# EAGLE schematic expansion_board_V0 (EAGLE 7.6.0)

## Sheet 1 of 8
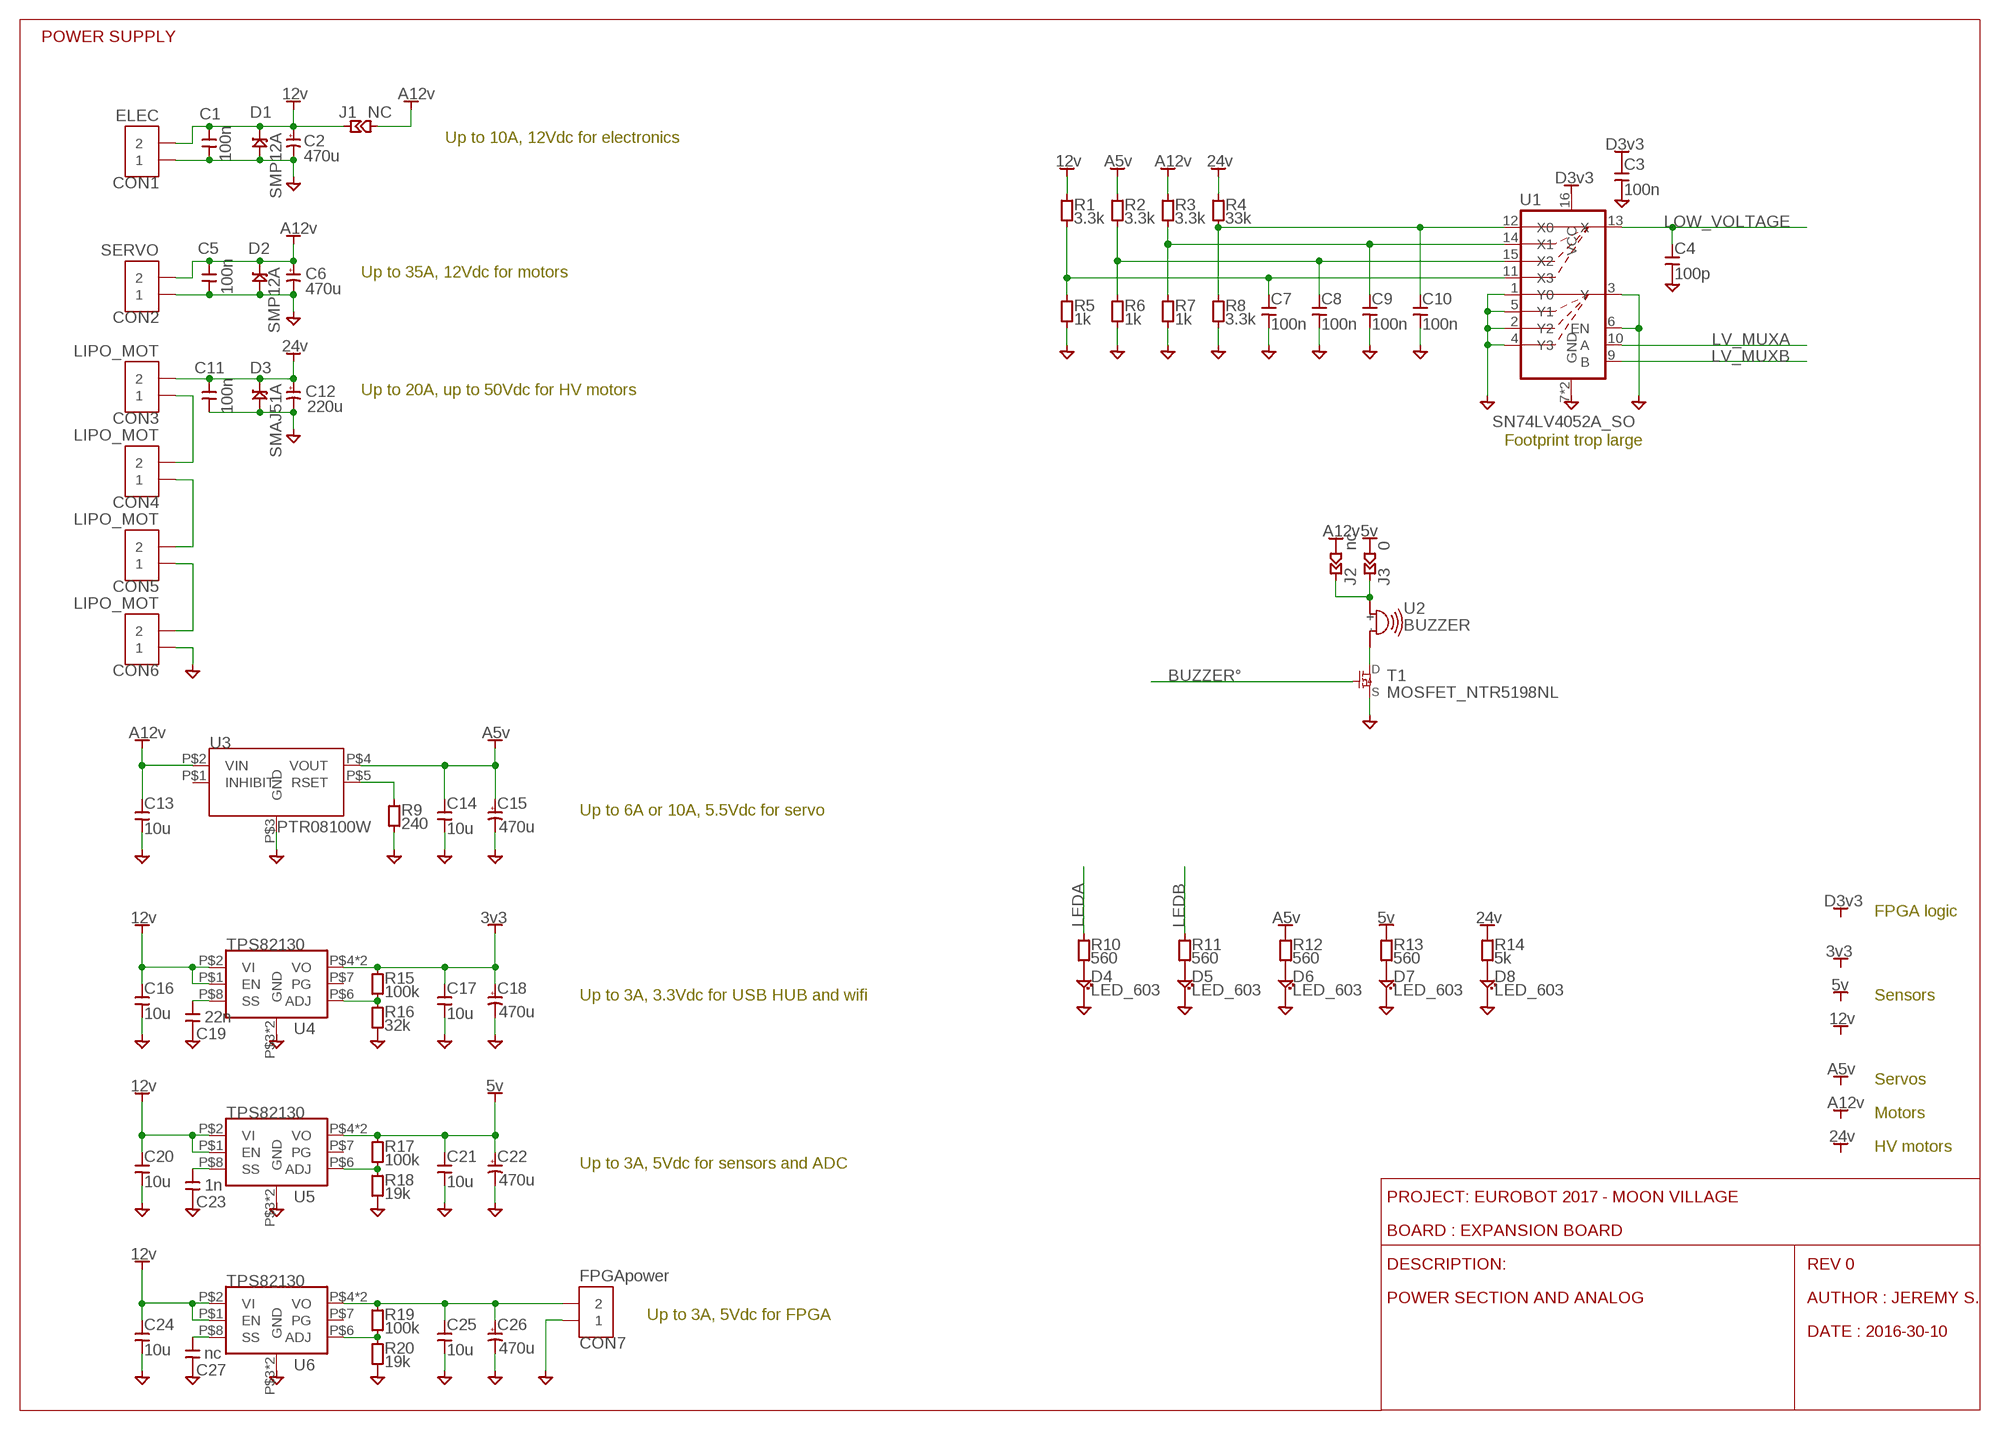
[diagram p0: schematic, sheet 1]

### Parts
C1  100n  C_402  [CAPC1005X55N]
C2  470u  CPOL  [CAPAE835X1020N]
C3  100n  C_402  [CAPC1005X55N]
C4  100p  C_402  [CAPC1005X55N]
C5  100n  C_402  [CAPC1005X55N]
C6  470u  CPOL  [CAPAE835X1020N]
C7  100n  C_402  [CAPC1005X55N]
C8  100n  C_402  [CAPC1005X55N]
C9  100n  C_402  [CAPC1005X55N]
C10  100n  C_402  [CAPC1005X55N]
C11  100n  C_805  [CAPC2013X100N]
C12  220u  CPOL  [CAPAE835X1020N]
C13  10u  C_805  [CAPC2013X100N]
C14  10u  C_805  [CAPC2013X100N]
C15  470u  CPOL  [CAPAE835X1020N]
C16  10u  C_805  [CAPC2013X100N]
C17  10u  C_805  [CAPC2013X100N]
C18  470u  CPOL  [CAPAE835X1020N]
C19  22n  C_402  [CAPC1005X55N]
C20  10u  C_805  [CAPC2013X100N]
C21  10u  C_805  [CAPC2013X100N]
C22  470u  CPOL  [CAPAE835X1020N]
C23  1n  C_402  [CAPC1005X55N]
C24  10u  C_805  [CAPC2013X100N]
C25  10u  C_805  [CAPC2013X100N]
C26  470u  CPOL  [CAPAE835X1020N]
C27  nc  C_402  [CAPC1005X55N]
CON1  ELEC  CON2_3.81  [PHOENIX381P900X920-2N]
CON2  SERVO  CON2_3.81  [PHOENIX381P900X920-2N]
CON3  LIPO_MOT  CON2_3.81  [PHOENIX381P900X920-2N]
CON4  LIPO_MOT  CON2_3.81  [PHOENIX381P900X920-2N]
CON5  LIPO_MOT  CON2_3.81  [PHOENIX381P900X920-2N]
CON6  LIPO_MOT  CON2_3.81  [PHOENIX381P900X920-2N]
CON7  FPGApower  CON2_3.81  [PHOENIX381P900X920-2N]
D1  SMP12A  ZENER  [DO220AA]
D2  SMP12A  ZENER  [DO220AA]
D3  SMAJ51A  ZENERDO214  [D0214AC]
D4  LED_603  [LEDC1608X60N]
D5  LED_603  [LEDC1608X60N]
D6  LED_603  [LEDC1608X60N]
D7  LED_603  [LEDC1608X60N]
D8  LED_603  [LEDC1608X60N]
J1  NC  JUMP_603  [JUMC1608X50AN]
J2  nc  JUMP_402  [JUMC1005X50N]
J3  0  JUMP_402  [JUMC1005X50N]
R1  3.3k  R_402  [RESC1005X40N]
R2  3.3k  R_402  [RESC1005X40N]
R3  3.3k  R_402  [RESC1005X40N]
R4  33k  R_402  [RESC1005X40N]
R5  1k  R_402  [RESC1005X40N]
R6  1k  R_402  [RESC1005X40N]
R7  1k  R_402  [RESC1005X40N]
R8  3.3k  R_402  [RESC1005X40N]
R9  240  R_402  [RESC1005X40N]
R10  560  R_402  [RESC1005X40N]
R11  560  R_402  [RESC1005X40N]
R12  560  R_402  [RESC1005X40N]
R13  560  R_402  [RESC1005X40N]
R14  5k  R_402  [RESC1005X40N]
R15  100k  R_402  [RESC1005X40N]
R16  32k  R_402  [RESC1005X40N]
R17  100k  R_402  [RESC1005X40N]
R18  19k  R_402  [RESC1005X40N]
R19  100k  R_402  [RESC1005X40N]
R20  19k  R_402  [RESC1005X40N]
T1  MOSFET_NTR5198NL  [SOT95P290X130-3N]
U1  SN74LV4052A_SO  [SOIC127P780X200-16N]
U2  BUZZER  [BUZZER_CIRCLE]
U3  PTR08100W  [PTR08100W]
U4  TPS82130  [SON65P310X290X153-9N]
U5  TPS82130  [SON65P310X290X153-9N]
U6  TPS82130  [SON65P310X290X153-9N]

### Nets
3V3: C17.P$1 C18.+ R15.1 U4.P$4(VO) U4.P$5(VO) ; also sheet 5
5V: C21.P$1 C22.+ J3.P$1 R13.1 R17.1 U5.P$4(VO) U5.P$5(VO) ; also sheet 2,3,4,5,6,7
12V: C1.1 C2.+ C16.P$1 C20.P$1 C24.P$1 CON1.P$2 D1.C J1.P$2 R1.1 U4.P$1(EN) U4.P$2(VI) U5.P$1(EN) U5.P$2(VI) U6.P$1(EN) U6.P$2(VI) ; also sheet 4
24V: C11.P$1 C12.+ CON3.P$2 D3.C R4.1 R14.1 ; also sheet 2,3
A5V: C14.P$1 C15.+ R2.1 R12.1 U3.P$4(VOUT) ; also sheet 3,4
A12V: C5.1 C6.+ C13.P$1 CON2.P$2 D2.C J1.P$1 J2.P$1 R3.1 U3.P$2(VIN) ; also sheet 2,3
BUZZER°: T1.P$1(G) ; also sheet 7
D3V3: C3.1 U1.16(VCC) ; also sheet 6,7
GND: C1.2 C2.- C3.2 C4.2 C5.2 C6.- C7.2 C8.2 C9.2 C10.2 C11.P$2 C12.- C13.P$2 C14.P$2 C15.- C16.P$2 C17.P$2 C18.- C19.2 C20.P$2 C21.P$2 C22.- C23.2 C24.P$2 C25.P$2 C26.- C27.2 CON1.P$1 CON2.P$1 CON6.P$1 CON7.P$1 D1.A D2.A D3.A D4.C D5.C D6.C D7.C D8.C R5.2 R6.2 R7.2 R8.2 R9.2 R16.2 R18.2 R20.2 T1.P$2(S) U1.1(Y0) U1.2(Y2) U1.3(Y) U1.4(Y3) U1.5(Y1) U1.6(EN) U1.7(GND) U1.8(GND) U3.P$3(GND) U4.P$3(GND) U4.P$9(GND) U5.P$3(GND) U5.P$9(GND) U6.P$3(GND) U6.P$9(GND) ; also sheet 2,3,4,5,6,7,8
LEDA: R10.1 ; also sheet 7
LEDB: R11.1 ; also sheet 7
LOW_VOLTAGE: C4.1 U1.13(X) ; also sheet 6
LV_MUXA: U1.10(A) ; also sheet 7
LV_MUXB: U1.9(B) ; also sheet 7
N$1: CON3.P$1 CON4.P$2
N$3: CON4.P$1 CON5.P$2
N$4: CON5.P$1 CON6.P$2
N$41: D6.A R12.2
N$42: R15.2 R16.1 U4.P$6(ADJ)
N$61: D5.A R11.2
N$64: D4.A R10.2
N$157: C19.1 U4.P$8(SS)
N$198: R17.2 R18.1 U5.P$6(ADJ)
N$199: C23.1 U5.P$8(SS)
N$200: R9.1 U3.P$5(RSET)
N$201: R19.2 R20.1 U6.P$6(ADJ)
N$202: C27.1 U6.P$8(SS)
N$204: D7.A R13.2
N$205: D8.A R14.2
N$206: C25.P$1 C26.+ CON7.P$2 R19.1 U6.P$4(VO) U6.P$5(VO)
N$207: C7.1 R1.2 R5.1 U1.11(X3)
N$210: C10.1 R4.2 R8.1 U1.12(X0)
N$211: C8.1 R2.2 R6.1 U1.15(X2)
N$212: C9.1 R3.2 R7.1 U1.14(X1)
N$213: T1.P$3(D) U2.-
N$214: J2.P$2 J3.P$2 U2.+
Unconnected: U3.P$1(INHIBIT) U4.P$7(PG) U5.P$7(PG) U6.P$7(PG)

### Notes on the sheet
- POWER SUPPLY
- Up to 10A, 12Vdc for electronics
- Up to 35A, 12Vdc for motors
- Up to 20A, up to 50Vdc for HV motors
- Footprint trop large
- Up to 6A or 10A, 5.5Vdc for servo
- FPGA logic
- Up to 3A, 3.3Vdc for USB HUB and wifi | Sensors
- Servos
- Motors
- HV motors
- Up to 3A, 5Vdc for sensors and ADC
- PROJECT: EUROBOT 2017 - MOON VILLAGE
- BOARD : EXPANSION BOARD
- DESCRIPTION: | REV 0
- POWER SECTION AND ANALOG | AUTHOR : JEREMY S.
- Up to 3A, 5Vdc for FPGA
- DATE : 2016-30-10

## Sheet 2 of 8
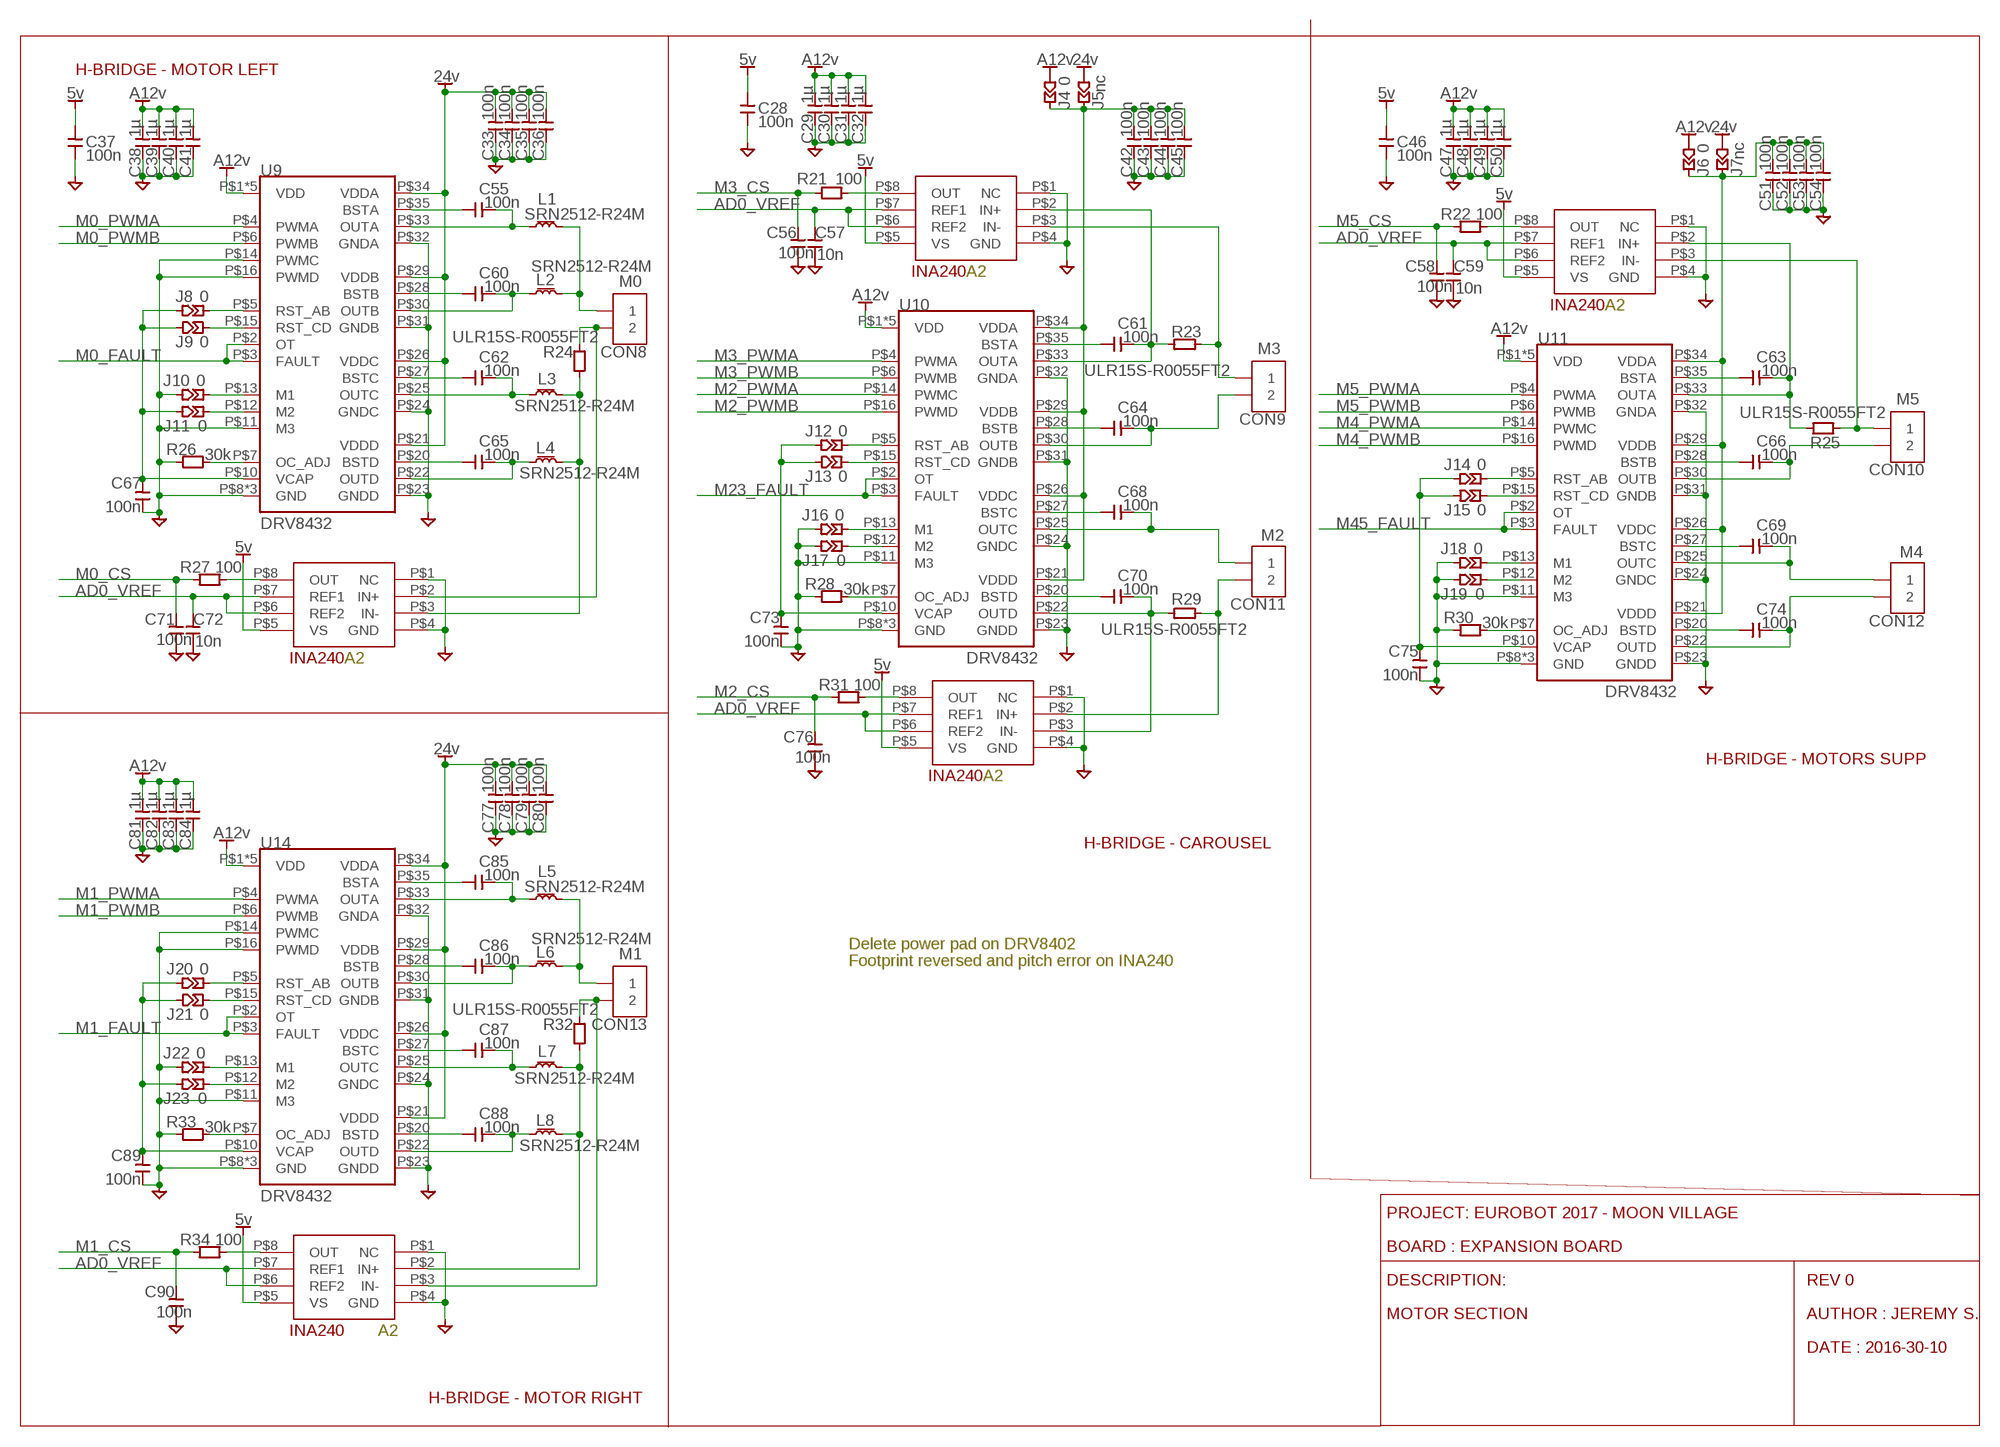
[diagram p1: schematic, sheet 2]

### Parts
C28  100n  C_402  [CAPC1005X55N]
C29  1µ  C_603  [CAPC1608X95N]
C30  1µ  C_603  [CAPC1608X95N]
C31  1µ  C_603  [CAPC1608X95N]
C32  1µ  C_603  [CAPC1608X95N]
C33  100n  C_603  [CAPC1608X95N]
C34  100n  C_603  [CAPC1608X95N]
C35  100n  C_603  [CAPC1608X95N]
C36  100n  C_603  [CAPC1608X95N]
C37  100n  C_402  [CAPC1005X55N]
C38  1µ  C_603  [CAPC1608X95N]
C39  1µ  C_603  [CAPC1608X95N]
C40  1µ  C_603  [CAPC1608X95N]
C41  1µ  C_603  [CAPC1608X95N]
C42  100n  C_603  [CAPC1608X95N]
C43  100n  C_603  [CAPC1608X95N]
C44  100n  C_603  [CAPC1608X95N]
C45  100n  C_603  [CAPC1608X95N]
C46  100n  C_402  [CAPC1005X55N]
C47  1µ  C_603  [CAPC1608X95N]
C48  1µ  C_603  [CAPC1608X95N]
C49  1µ  C_603  [CAPC1608X95N]
C50  1µ  C_603  [CAPC1608X95N]
C51  100n  C_603  [CAPC1608X95N]
C52  100n  C_603  [CAPC1608X95N]
C53  100n  C_603  [CAPC1608X95N]
C54  100n  C_603  [CAPC1608X95N]
C55  100n  C_603  [CAPC1608X95N]
C56  100n  C_402  [CAPC1005X55N]
C57  10n  C_402  [CAPC1005X55N]
C58  100n  C_402  [CAPC1005X55N]
C59  10n  C_402  [CAPC1005X55N]
C60  100n  C_603  [CAPC1608X95N]
C61  100n  C_603  [CAPC1608X95N]
C62  100n  C_603  [CAPC1608X95N]
C63  100n  C_603  [CAPC1608X95N]
C64  100n  C_603  [CAPC1608X95N]
C65  100n  C_603  [CAPC1608X95N]
C66  100n  C_603  [CAPC1608X95N]
C67  100n  C_402  [CAPC1005X55N]
C68  100n  C_603  [CAPC1608X95N]
C69  100n  C_603  [CAPC1608X95N]
C70  100n  C_603  [CAPC1608X95N]
C71  100n  C_402  [CAPC1005X55N]
C72  10n  C_402  [CAPC1005X55N]
C73  100n  C_402  [CAPC1005X55N]
C74  100n  C_603  [CAPC1608X95N]
C75  100n  C_402  [CAPC1005X55N]
C76  100n  C_402  [CAPC1005X55N]
C77  100n  C_603  [CAPC1608X95N]
C78  100n  C_603  [CAPC1608X95N]
C79  100n  C_603  [CAPC1608X95N]
C80  100n  C_603  [CAPC1608X95N]
C81  1µ  C_603  [CAPC1608X95N]
C82  1µ  C_603  [CAPC1608X95N]
C83  1µ  C_603  [CAPC1608X95N]
C84  1µ  C_603  [CAPC1608X95N]
C85  100n  C_603  [CAPC1608X95N]
C86  100n  C_603  [CAPC1608X95N]
C87  100n  C_603  [CAPC1608X95N]
C88  100n  C_603  [CAPC1608X95N]
C89  100n  C_402  [CAPC1005X55N]
C90  100n  C_402  [CAPC1005X55N]
CON8  M0  CON2_3.81  [PHOENIX381P900X920-2N]
CON9  M3  CON2_3.81  [PHOENIX381P900X920-2N]
CON10  M5  CON2_3.81  [PHOENIX381P900X920-2N]
CON11  M2  CON2_3.81  [PHOENIX381P900X920-2N]
CON12  M4  CON2_3.81  [PHOENIX381P900X920-2N]
CON13  M1  CON2_3.81  [PHOENIX381P900X920-2N]
J4  0  JUMP_603  [JUMC1608X50AN]
J5  nc  JUMP_603  [JUMC1608X50AN]
J6  0  JUMP_603  [JUMC1608X50AN]
J7  nc  JUMP_603  [JUMC1608X50AN]
J8  0  JUMP_402  [JUMC1005X50N]
J9  0  JUMP_402  [JUMC1005X50N]
J10  0  JUMP_402  [JUMC1005X50N]
J11  0  JUMP_402  [JUMC1005X50N]
J12  0  JUMP_402  [JUMC1005X50N]
J13  0  JUMP_402  [JUMC1005X50N]
J14  0  JUMP_402  [JUMC1005X50N]
J15  0  JUMP_402  [JUMC1005X50N]
J16  0  JUMP_402  [JUMC1005X50N]
J17  0  JUMP_402  [JUMC1005X50N]
J18  0  JUMP_402  [JUMC1005X50N]
J19  0  JUMP_402  [JUMC1005X50N]
J20  0  JUMP_402  [JUMC1005X50N]
J21  0  JUMP_402  [JUMC1005X50N]
J22  0  JUMP_402  [JUMC1005X50N]
J23  0  JUMP_402  [JUMC1005X50N]
L1  SRN2512-R24M  INDUCTANCE_2520  [INDC2520X120N]
L2  SRN2512-R24M  INDUCTANCE_2520  [INDC2520X120N]
L3  SRN2512-R24M  INDUCTANCE_2520  [INDC2520X120N]
L4  SRN2512-R24M  INDUCTANCE_2520  [INDC2520X120N]
L5  SRN2512-R24M  INDUCTANCE_2520  [INDC2520X120N]
L6  SRN2512-R24M  INDUCTANCE_2520  [INDC2520X120N]
L7  SRN2512-R24M  INDUCTANCE_2520  [INDC2520X120N]
L8  SRN2512-R24M  INDUCTANCE_2520  [INDC2520X120N]
R21  100  R_402  [RESC1005X40N]
R22  100  R_402  [RESC1005X40N]
R23  ULR15S-R0055FT2  R_ULR15S-R0055FT2  [RESC_ULR15S-R0055FT2]
R24  ULR15S-R0055FT2  R_ULR15S-R0055FT2  [RESC_ULR15S-R0055FT2]
R25  ULR15S-R0055FT2  R_ULR15S-R0055FT2  [RESC_ULR15S-R0055FT2]
R26  30k  R_402  [RESC1005X40N]
R27  100  R_402  [RESC1005X40N]
R28  30k  R_402  [RESC1005X40N]
R29  ULR15S-R0055FT2  R_ULR15S-R0055FT2  [RESC_ULR15S-R0055FT2]
R30  30k  R_402  [RESC1005X40N]
R31  100  R_402  [RESC1005X40N]
R32  ULR15S-R0055FT2  R_ULR15S-R0055FT2  [RESC_ULR15S-R0055FT2]
R33  30k  R_402  [RESC1005X40N]
R34  100  R_402  [RESC1005X40N]
U7  INA240-A2  INA240-TSSOP  [TSSOP]
U8  INA240-A2  INA240-TSSOP  [TSSOP]
U9  DRV8432  DRV84X2_DRV8432  [R-PDSO-G36]
U10  DRV8432  DRV84X2_DRV8432  [R-PDSO-G36]
U11  DRV8432  DRV84X2_DRV8432  [R-PDSO-G36]
U12  INA240-A2  INA240-TSSOP  [TSSOP]
U13  INA240-A2  INA240-TSSOP  [TSSOP]
U14  DRV8432  DRV84X2_DRV8432  [R-PDSO-G36]
U15  INA240-A2  INA240-TSSOP  [TSSOP]

### Nets
5V: C28.2 C37.2 C46.2 U7.P$5(VS) U8.P$5(VS) U12.P$5(VS) U13.P$5(VS) U15.P$5(VS) ; also sheet 1,3,4,5,6,7
24V: C33.P$2 C34.P$2 C35.P$2 C36.P$2 C77.P$2 C78.P$2 C79.P$2 C80.P$2 J5.P$1 J7.P$1 U9.P$21(VDDD) U9.P$26(VDDC) U9.P$29(VDDB) U9.P$34(VDDA) U14.P$21(VDDD) U14.P$26(VDDC) U14.P$29(VDDB) U14.P$34(VDDA) ; also sheet 1,3
A12V: C29.P$2 C30.P$2 C31.P$2 C32.P$2 C38.P$2 C39.P$2 C40.P$2 C41.P$2 C47.P$2 C48.P$2 C49.P$2 C50.P$2 C81.P$2 C82.P$2 C83.P$2 C84.P$2 J4.P$1 J6.P$1 U9.P$1(VDD) U9.P$17(VDD) U9.P$18(VDD) U9.P$19(VDD) U9.P$36(VDD) U10.P$1(VDD) U10.P$17(VDD) U10.P$18(VDD) U10.P$19(VDD) U10.P$36(VDD) U11.P$1(VDD) U11.P$17(VDD) U11.P$18(VDD) U11.P$19(VDD) U11.P$36(VDD) U14.P$1(VDD) U14.P$17(VDD) U14.P$18(VDD) U14.P$19(VDD) U14.P$36(VDD) ; also sheet 1,3
AD0_VREF: C57.2 C59.2 C72.2 U7.P$6(REF2) U7.P$7(REF1) U8.P$6(REF2) U8.P$7(REF1) U12.P$6(REF2) U12.P$7(REF1) U13.P$6(REF2) U13.P$7(REF1) U15.P$6(REF2) U15.P$7(REF1) ; also sheet 3,6
GND: C28.1 C29.P$1 C30.P$1 C31.P$1 C32.P$1 C33.P$1 C34.P$1 C35.P$1 C36.P$1 C37.1 C38.P$1 C39.P$1 C40.P$1 C41.P$1 C42.P$1 C43.P$1 C44.P$1 C45.P$1 C46.1 C47.P$1 C48.P$1 C49.P$1 C50.P$1 C51.P$1 C52.P$1 C53.P$1 C54.P$1 C56.1 C57.1 C58.1 C59.1 C67.1 C71.1 C72.1 C73.1 C75.1 C76.1 C77.P$1 C78.P$1 C79.P$1 C80.P$1 C81.P$1 C82.P$1 C83.P$1 C84.P$1 C89.1 C90.1 J10.P$1 J16.P$1 J17.P$1 J18.P$1 J19.P$1 J22.P$1 R26.2 R28.2 R30.2 R33.2 U7.P$1(NC) U7.P$4(GND) U8.P$1(NC) U8.P$4(GND) U9.P$8(GND) U9.P$9(GND) U9.P$11(M3) U9.P$14(PWMC) U9.P$16(PWMD) U9.P$23(GNDD) U9.P$24(GNDC) U9.P$31(GNDB) U9.P$32(GNDA) U9.P$37(GND) U10.P$8(GND) U10.P$9(GND) U10.P$11(M3) U10.P$23(GNDD) U10.P$24(GNDC) U10.P$31(GNDB) U10.P$32(GNDA) U10.P$37(GND) U11.P$8(GND) U11.P$9(GND) U11.P$11(M3) U11.P$23(GNDD) U11.P$24(GNDC) U11.P$31(GNDB) U11.P$32(GNDA) U11.P$37(GND) U12.P$1(NC) U12.P$4(GND) U13.P$1(NC) U13.P$4(GND) U14.P$8(GND) U14.P$9(GND) U14.P$11(M3) U14.P$14(PWMC) U14.P$16(PWMD) U14.P$23(GNDD) U14.P$24(GNDC) U14.P$31(GNDB) U14.P$32(GNDA) U14.P$37(GND) U15.P$1(NC) U15.P$4(GND) ; also sheet 1,3,4,5,6,7,8
M0_CS: C71.2 R27.2 ; also sheet 6
M0_FAULT: U9.P$2(OT) U9.P$3(FAULT) ; also sheet 7
M0_PWMA: U9.P$4(PWMA) ; also sheet 7
M0_PWMB: U9.P$6(PWMB) ; also sheet 7
M1_CS: C90.2 R34.2 ; also sheet 6
M1_FAULT: U14.P$2(OT) U14.P$3(FAULT) ; also sheet 7
M1_PWMA: U14.P$4(PWMA) ; also sheet 7
M1_PWMB: U14.P$6(PWMB) ; also sheet 7
M2_CS: C76.2 R31.2 ; also sheet 6
M2_PWMA: U10.P$14(PWMC) ; also sheet 7
M2_PWMB: U10.P$16(PWMD) ; also sheet 7
M3_CS: C56.2 R21.2 ; also sheet 6
M3_PWMA: U10.P$4(PWMA) ; also sheet 7
M3_PWMB: U10.P$6(PWMB) ; also sheet 7
M4_PWMA: U11.P$14(PWMC) ; also sheet 7
M4_PWMB: U11.P$16(PWMD) ; also sheet 7
M5_CS: C58.2 R22.2 ; also sheet 6
M5_PWMA: U11.P$4(PWMA) ; also sheet 7
M5_PWMB: U11.P$6(PWMB) ; also sheet 7
M23_FAULT: U10.P$2(OT) U10.P$3(FAULT) ; also sheet 7
M45_FAULT: U11.P$2(OT) U11.P$3(FAULT) ; also sheet 7
N$5: J13.P$2 U10.P$15(RST_CD)
N$7: C61.P$1 U10.P$35(BSTA)
N$8: C70.P$1 U10.P$20(BSTD)
N$9: CON8.P$2 R24.P$2 U12.P$2(IN+)
N$10: C68.P$1 U10.P$27(BSTC)
N$11: CON13.P$2 R32.P$2 U15.P$3(IN-)
N$12: C64.P$1 U10.P$28(BSTB)
N$13: CON10.P$1 R25.P$2 U8.P$3(IN-)
N$14: C61.P$2 R23.P$1 U7.P$2(IN+) U10.P$33(OUTA)
N$15: C74.P$2 CON12.P$2 U11.P$22(OUTD)
N$16: C64.P$2 CON9.P$2 U10.P$30(OUTB)
N$17: J20.P$2 U14.P$5(RST_AB)
N$18: J16.P$2 U10.P$13(M1)
N$19: J8.P$2 U9.P$5(RST_AB)
N$20: J12.P$2 U10.P$5(RST_AB)
N$22: J14.P$2 U11.P$5(RST_AB)
N$46: J17.P$2 U10.P$12(M2)
N$55: C68.P$2 CON11.P$1 U10.P$25(OUTC)
N$56: C70.P$2 R29.P$1 U10.P$22(OUTD) U13.P$3(IN-)
N$57: C73.2 J12.P$1 J13.P$1 U10.P$10(VCAP)
N$60: CON9.P$1 R23.P$2 U7.P$3(IN-)
N$62: R28.1 U10.P$7(OC_ADJ)
N$65: R21.1 U7.P$8(OUT)
N$76: CON11.P$2 R29.P$2 U13.P$2(IN+)
N$77: C63.P$1 U11.P$35(BSTA)
N$78: C74.P$1 U11.P$20(BSTD)
N$79: C69.P$1 U11.P$27(BSTC)
N$80: C66.P$1 U11.P$28(BSTB)
N$81: C63.P$2 R25.P$1 U8.P$2(IN+) U11.P$33(OUTA)
N$82: C66.P$2 CON10.P$2 U11.P$30(OUTB)
N$83: C69.P$2 CON12.P$1 U11.P$25(OUTC)
N$85: C75.2 J14.P$1 J15.P$1 U11.P$10(VCAP)
N$86: R30.1 U11.P$7(OC_ADJ)
N$87: C42.P$2 C43.P$2 C44.P$2 C45.P$2 J4.P$2 J5.P$2 U10.P$21(VDDD) U10.P$26(VDDC) U10.P$29(VDDB) U10.P$34(VDDA)
N$88: J15.P$2 U11.P$15(RST_CD)
N$89: R31.1 U13.P$8(OUT)
N$90: J18.P$2 U11.P$13(M1)
N$91: J19.P$2 U11.P$12(M2)
N$92: C51.P$2 C52.P$2 C53.P$2 C54.P$2 J6.P$2 J7.P$2 U11.P$21(VDDD) U11.P$26(VDDC) U11.P$29(VDDB) U11.P$34(VDDA)
N$99: C85.P$1 U14.P$35(BSTA)
N$100: C88.P$1 U14.P$20(BSTD)
N$101: C87.P$1 U14.P$27(BSTC)
N$102: C86.P$1 U14.P$28(BSTB)
N$103: C85.P$2 L5.P$2 U14.P$33(OUTA)
N$104: C86.P$2 L6.P$2 U14.P$30(OUTB)
N$105: C87.P$2 L7.P$2 U14.P$25(OUTC)
N$106: C88.P$2 L8.P$2 U14.P$22(OUTD)
N$114: C89.2 J20.P$1 J21.P$1 J23.P$1 U14.P$10(VCAP)
N$115: R33.1 U14.P$7(OC_ADJ)
N$116: C55.P$1 U9.P$35(BSTA)
N$117: J21.P$2 U14.P$15(RST_CD)
N$118: J22.P$2 U14.P$13(M1)
N$119: J23.P$2 U14.P$12(M2)
N$120: C65.P$1 U9.P$20(BSTD)
N$121: R34.1 U15.P$8(OUT)
N$123: C62.P$1 U9.P$27(BSTC)
N$124: L7.P$1 L8.P$1 R32.P$1 U15.P$2(IN+)
N$125: C60.P$1 U9.P$28(BSTB)
N$126: CON13.P$1 L5.P$1 L6.P$1
N$127: C55.P$2 L1.P$2 U9.P$33(OUTA)
N$128: C60.P$2 L2.P$2 U9.P$30(OUTB)
N$129: C62.P$2 L3.P$2 U9.P$25(OUTC)
N$130: C65.P$2 L4.P$2 U9.P$22(OUTD)
N$131: C67.2 J8.P$1 J9.P$1 J11.P$1 U9.P$10(VCAP)
N$132: R26.1 U9.P$7(OC_ADJ)
N$133: J9.P$2 U9.P$15(RST_CD)
N$134: J10.P$2 U9.P$13(M1)
N$135: J11.P$2 U9.P$12(M2)
N$136: R27.1 U12.P$8(OUT)
N$138: L3.P$1 L4.P$1 R24.P$1 U12.P$3(IN-)
N$139: CON8.P$1 L1.P$1 L2.P$1
N$208: R22.1 U8.P$8(OUT)

### Notes on the sheet
- H-BRIDGE - MOTOR LEFT
- A2
- A2
- A2
- H-BRIDGE - MOTORS SUPP
- A2
- H-BRIDGE - CAROUSEL
- Delete power pad on DRV8402
- Footprint reversed and pitch error on INA240
- PROJECT: EUROBOT 2017 - MOON VILLAGE
- BOARD : EXPANSION BOARD
- DESCRIPTION: | REV 0
- MOTOR SECTION | AUTHOR : JEREMY S.
- A2
- DATE : 2016-30-10
- H-BRIDGE - MOTOR RIGHT

## Sheet 3 of 8
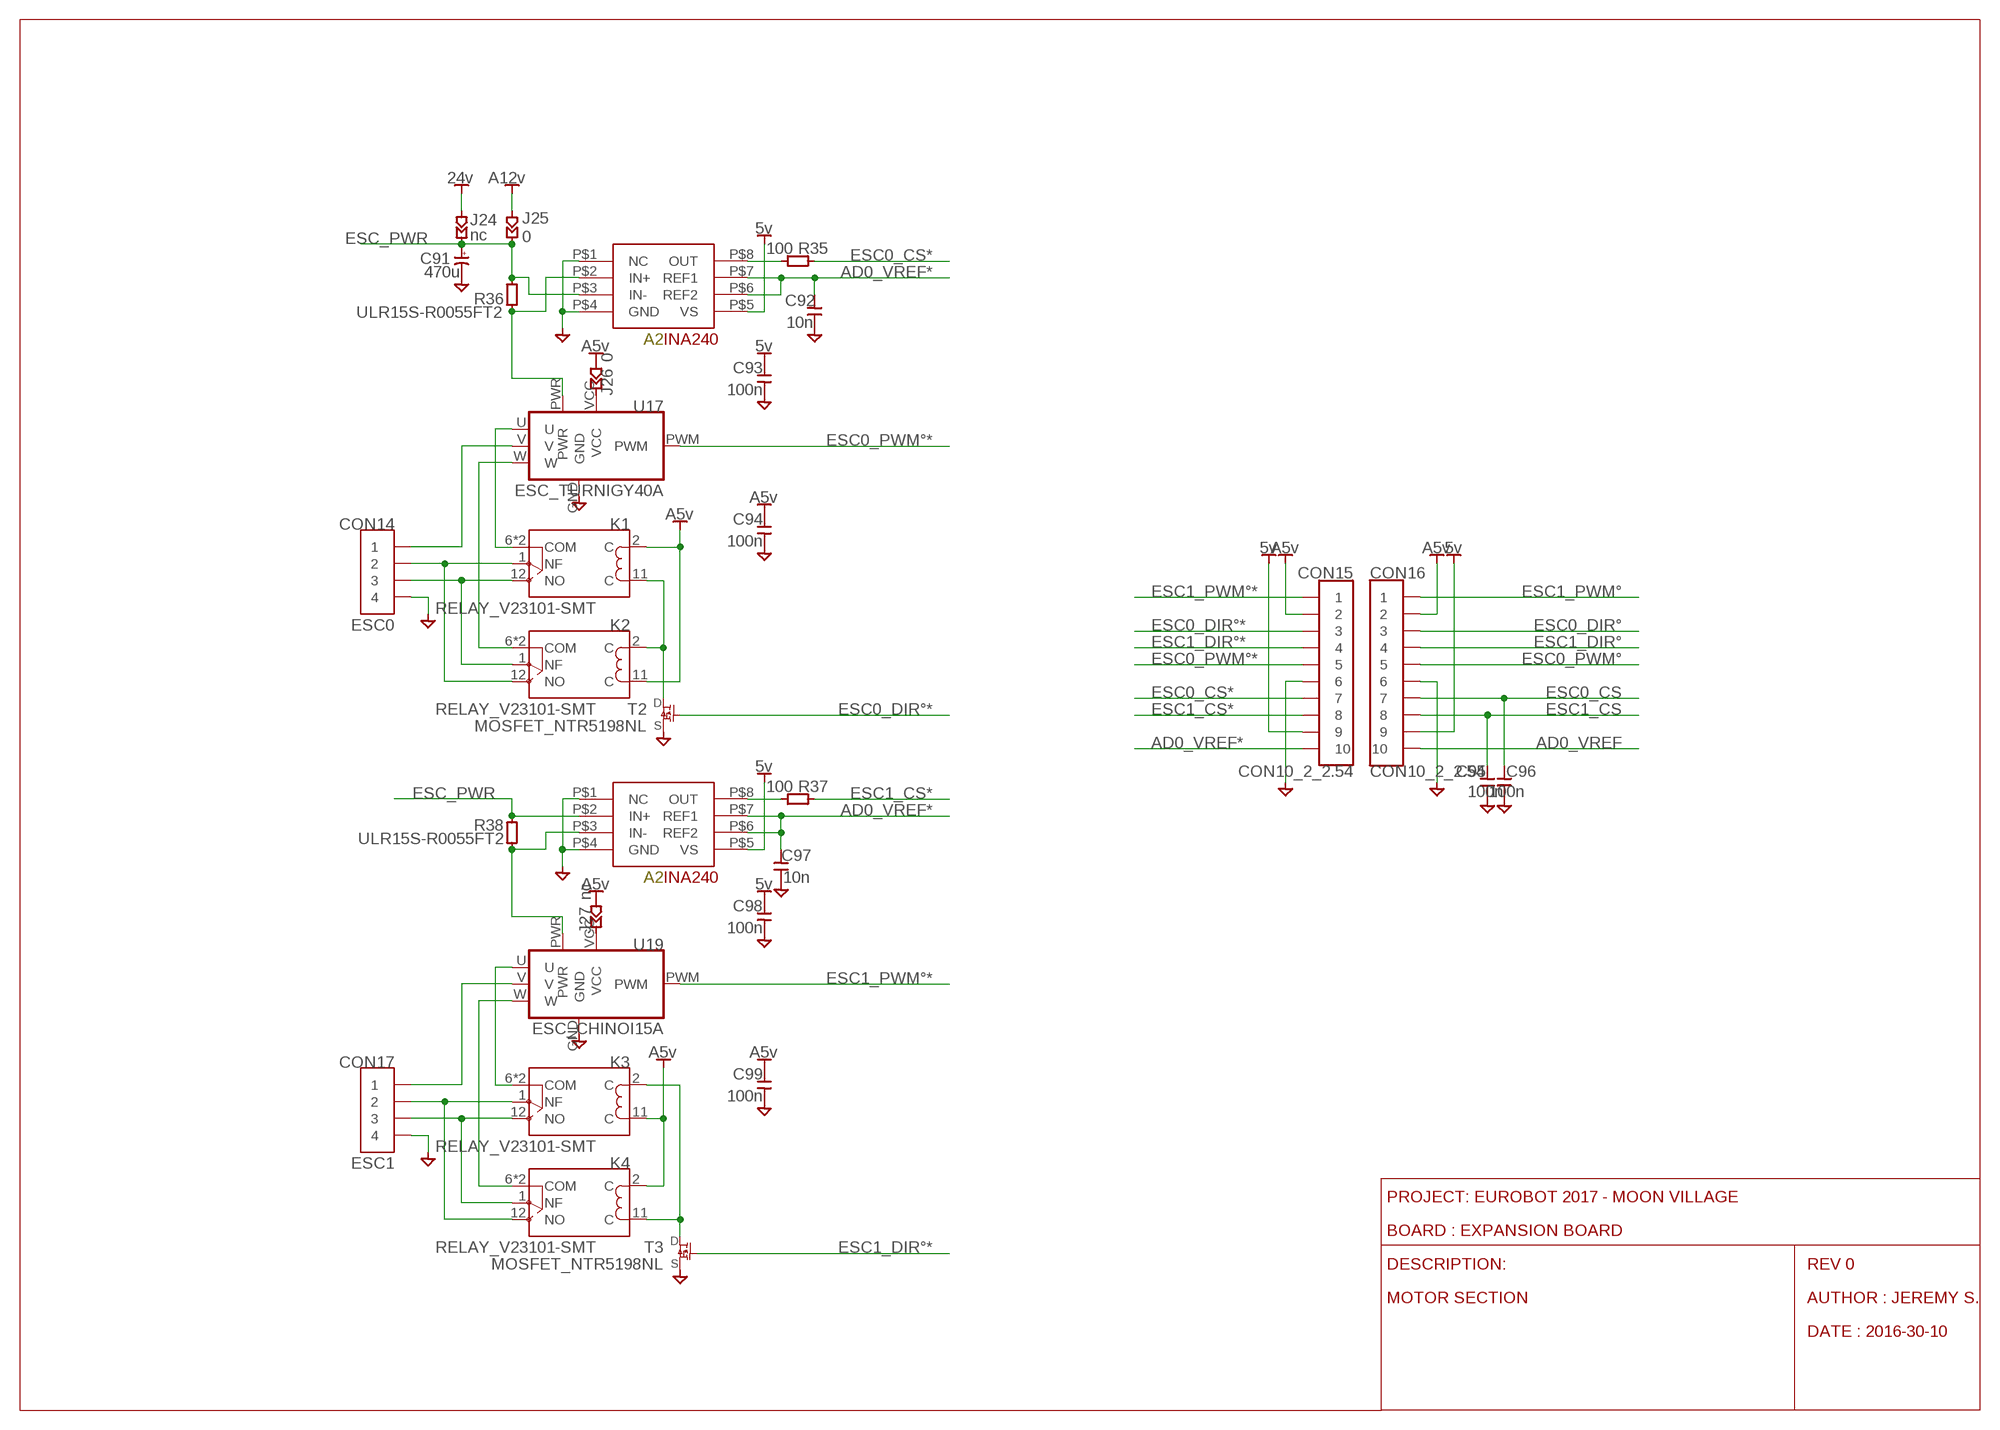
[diagram p2: schematic, sheet 3]

### Parts
C91  470u  CPOL  [CAPAE835X1020N]
C92  10n  C_402  [CAPC1005X55N]
C93  100n  C_402  [CAPC1005X55N]
C94  100n  C_402  [CAPC1005X55N]
C95  100n  C_402  [CAPC1005X55N]
C96  100n  C_402  [CAPC1005X55N]
C97  10n  C_402  [CAPC1005X55N]
C98  100n  C_402  [CAPC1005X55N]
C99  100n  C_402  [CAPC1005X55N]
CON14  ESC0  CON4_3.81  [PHOENIX381P1662X920-4N]
CON15  CON10_2_2.54  [CON245P2030X890-2X5N]
CON16  CON10_2_2.54  [CON245P2030X890-2X5N]
CON17  ESC1  CON4_3.81  [PHOENIX381P1662X920-4N]
J24  nc  JUMP_603  [JUMC1608X50AN]
J25  0  JUMP_603  [JUMC1608X50AN]
J26  0  JUMP_402  [JUMC1005X50N]
J27  nc  JUMP_402  [JUMC1005X50N]
K1  RELAY_V23101-SMT  [V23101-D0103-A201-SMT]
K2  RELAY_V23101-SMT  [V23101-D0103-A201-SMT]
K3  RELAY_V23101-SMT  [V23101-D0103-A201-SMT]
K4  RELAY_V23101-SMT  [V23101-D0103-A201-SMT]
R35  100  R_402  [RESC1005X40N]
R36  ULR15S-R0055FT2  R_ULR15S-R0055FT2  [RESC_ULR15S-R0055FT2]
R37  100  R_402  [RESC1005X40N]
R38  ULR15S-R0055FT2  R_ULR15S-R0055FT2  [RESC_ULR15S-R0055FT2]
T2  MOSFET_NTR5198NL  [SOT95P290X130-3N]
T3  MOSFET_NTR5198NL  [SOT95P290X130-3N]
U16  INA240-A2  INA240-TSSOP  [TSSOP]
U17  ESC_TURNIGY40A  [ESC_TURNIGY40A]
U18  INA240-A2  INA240-TSSOP  [TSSOP]
U19  ESC_CHINOI15A  [ESC_CHINOI15A]

### Nets
5V: C93.1 C98.1 CON15.P$9 CON16.P$9 U16.P$5(VS) U18.P$5(VS) ; also sheet 1,2,4,5,6,7
24V: J24.P$1 ; also sheet 1,2
A5V: C94.1 C99.1 CON15.P$2 CON16.P$2 J26.P$1 J27.P$1 K1.2(C) K2.11(C) K3.11(C) K4.2(C) ; also sheet 1,4
A12V: J25.P$1 ; also sheet 1,2
AD0_VREF: CON16.P$10 ; also sheet 2,6
AD0_VREF*: C92.2 C97.2 CON15.P$10 U16.P$6(REF2) U16.P$7(REF1) U18.P$6(REF2) U18.P$7(REF1)
ESC0_CS: C96.2 CON16.P$7 ; also sheet 6
ESC0_CS*: CON15.P$7 R35.2
ESC0_DIR°: CON16.P$3 ; also sheet 7
ESC0_DIR°*: CON15.P$3 T2.P$1(G)
ESC0_PWM°: CON16.P$5 ; also sheet 7
ESC0_PWM°*: CON15.P$5 U17.PWM
ESC1_CS: C95.2 CON16.P$8 ; also sheet 6
ESC1_CS*: CON15.P$8 R37.2
ESC1_DIR°: CON16.P$4 ; also sheet 7
ESC1_DIR°*: CON15.P$4 T3.P$1(G)
ESC1_PWM°: CON16.P$1 ; also sheet 7
ESC1_PWM°*: CON15.P$1 U19.PWM
ESC_PWR: C91.+ J24.P$2 J25.P$2 R36.P$2 R38.P$2 U16.P$3(IN-) U18.P$2(IN+)
GND: C91.- C92.1 C93.2 C94.2 C95.1 C96.1 C97.1 C98.2 C99.2 CON14.P$4 CON15.P$6 CON16.P$6 CON17.P$4 T2.P$2(S) T3.P$2(S) U16.P$1(NC) U16.P$4(GND) U17.GND U18.P$1(NC) U18.P$4(GND) U19.GND ; also sheet 1,2,4,5,6,7,8
N$52: K3.2(C) K4.11(C) T3.P$3(D)
N$63: K1.11(C) K2.2(C) T2.P$3(D)
N$177: K2.6(COM) K2.7(COM) U17.W
N$178: K1.6(COM) K1.7(COM) U17.U
N$180: CON14.P$2 K1.1(NF) K2.12(NO)
N$181: CON14.P$3 K1.12(NO) K2.1(NF)
N$182: CON14.P$1 U17.V
N$184: R35.1 U16.P$8(OUT)
N$185: R36.P$1 U16.P$2(IN+) U17.PWR
N$187: J27.P$2 U19.VCC
N$188: J26.P$2 U17.VCC
N$189: K4.6(COM) K4.7(COM) U19.W
N$190: K3.6(COM) K3.7(COM) U19.U
N$191: CON17.P$2 K3.1(NF) K4.12(NO)
N$192: CON17.P$3 K3.12(NO) K4.1(NF)
N$193: CON17.P$1 U19.V
N$195: R37.1 U18.P$8(OUT)
N$196: R38.P$1 U18.P$3(IN-) U19.PWR

### Notes on the sheet
- A2
- A2
- PROJECT: EUROBOT 2017 - MOON VILLAGE
- BOARD : EXPANSION BOARD
- DESCRIPTION: | REV 0
- MOTOR SECTION | AUTHOR : JEREMY S.
- DATE : 2016-30-10

## Sheet 4 of 8
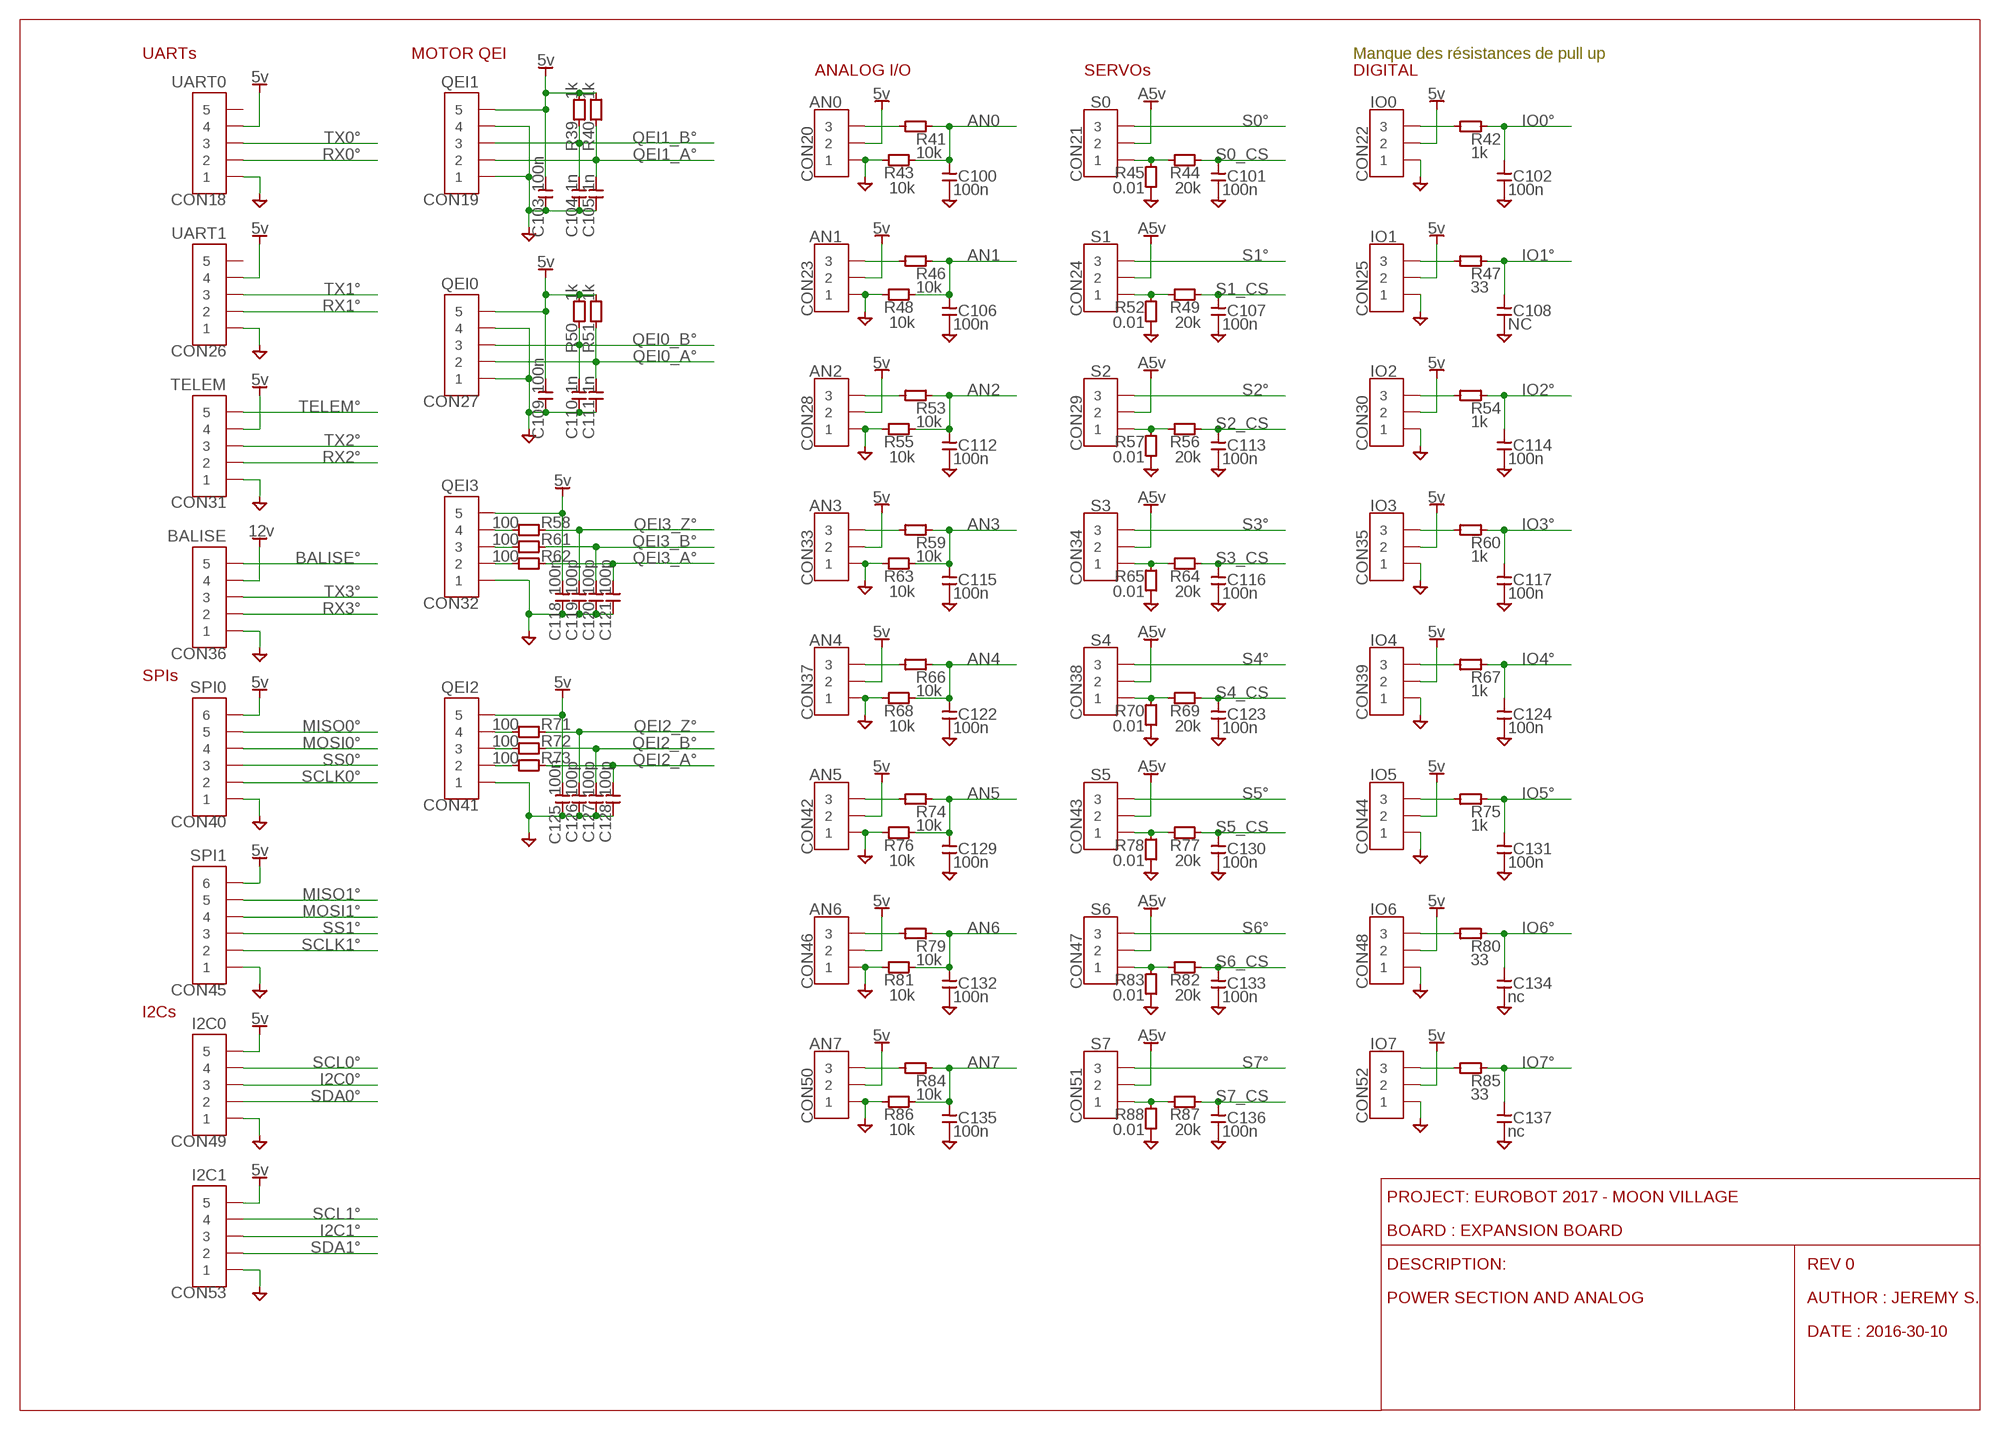
[diagram p3: schematic, sheet 4]

### Parts
C100  100n  C_402  [CAPC1005X55N]
C101  100n  C_402  [CAPC1005X55N]
C102  100n  C_402  [CAPC1005X55N]
C103  100n  C_402  [CAPC1005X55N]
C104  1n  C_402  [CAPC1005X55N]
C105  1n  C_402  [CAPC1005X55N]
C106  100n  C_402  [CAPC1005X55N]
C107  100n  C_402  [CAPC1005X55N]
C108  NC  C_402  [CAPC1005X55N]
C109  100n  C_402  [CAPC1005X55N]
C110  1n  C_402  [CAPC1005X55N]
C111  1n  C_402  [CAPC1005X55N]
C112  100n  C_402  [CAPC1005X55N]
C113  100n  C_402  [CAPC1005X55N]
C114  100n  C_402  [CAPC1005X55N]
C115  100n  C_402  [CAPC1005X55N]
C116  100n  C_402  [CAPC1005X55N]
C117  100n  C_402  [CAPC1005X55N]
C118  100n  C_402  [CAPC1005X55N]
C119  100p  C_402  [CAPC1005X55N]
C120  100p  C_402  [CAPC1005X55N]
C121  100p  C_402  [CAPC1005X55N]
C122  100n  C_402  [CAPC1005X55N]
C123  100n  C_402  [CAPC1005X55N]
C124  100n  C_402  [CAPC1005X55N]
C125  100n  C_402  [CAPC1005X55N]
C126  100p  C_402  [CAPC1005X55N]
C127  100p  C_402  [CAPC1005X55N]
C128  100p  C_402  [CAPC1005X55N]
C129  100n  C_402  [CAPC1005X55N]
C130  100n  C_402  [CAPC1005X55N]
C131  100n  C_402  [CAPC1005X55N]
C132  100n  C_402  [CAPC1005X55N]
C133  100n  C_402  [CAPC1005X55N]
C134  nc  C_402  [CAPC1005X55N]
C135  100n  C_402  [CAPC1005X55N]
C136  100n  C_402  [CAPC1005X55N]
C137  nc  C_402  [CAPC1005X55N]
CON18  UART0  CON5_2.54S  [CON254P1270X400-5S]
CON19  QEI1  CON5_2.54S  [CON254P1270X400-5S]
CON20  AN0  CON3_SMT  [CON254P762X400-3SMT]
CON21  S0  CON3_SMT  [CON254P762X400-3SMT]
CON22  IO0  CON3_SMT  [CON254P762X400-3SMT]
CON23  AN1  CON3_SMT  [CON254P762X400-3SMT]
CON24  S1  CON3_SMT  [CON254P762X400-3SMT]
CON25  IO1  CON3_SMT  [CON254P762X400-3SMT]
CON26  UART1  CON5_2.54S  [CON254P1270X400-5S]
CON27  QEI0  CON5_2.54S  [CON254P1270X400-5S]
CON28  AN2  CON3_SMT  [CON254P762X400-3SMT]
CON29  S2  CON3_SMT  [CON254P762X400-3SMT]
CON30  IO2  CON3_SMT  [CON254P762X400-3SMT]
CON31  TELEM  CON5_2.54S  [CON254P1270X400-5S]
CON32  QEI3  CON5_2.54S  [CON254P1270X400-5S]
CON33  AN3  CON3_SMT  [CON254P762X400-3SMT]
CON34  S3  CON3_SMT  [CON254P762X400-3SMT]
CON35  IO3  CON3_SMT  [CON254P762X400-3SMT]
CON36  BALISE  CON5_2.54S  [CON254P1270X400-5S]
CON37  AN4  CON3_SMT  [CON254P762X400-3SMT]
CON38  S4  CON3_SMT  [CON254P762X400-3SMT]
CON39  IO4  CON3_SMT  [CON254P762X400-3SMT]
CON40  SPI0  CON6_2.54S  [CON254P1524X400-6N-S]
CON41  QEI2  CON5_2.54S  [CON254P1270X400-5S]
CON42  AN5  CON3_SMT  [CON254P762X400-3SMT]
CON43  S5  CON3_SMT  [CON254P762X400-3SMT]
CON44  IO5  CON3_SMT  [CON254P762X400-3SMT]
CON45  SPI1  CON6_2.54S  [CON254P1524X400-6N-S]
CON46  AN6  CON3_SMT  [CON254P762X400-3SMT]
CON47  S6  CON3_SMT  [CON254P762X400-3SMT]
CON48  IO6  CON3_SMT  [CON254P762X400-3SMT]
CON49  I2C0  CON5_2.54S  [CON254P1270X400-5S]
CON50  AN7  CON3_SMT  [CON254P762X400-3SMT]
CON51  S7  CON3_SMT  [CON254P762X400-3SMT]
CON52  IO7  CON3_SMT  [CON254P762X400-3SMT]
CON53  I2C1  CON5_2.54S  [CON254P1270X400-5S]
R39  1k  R_402  [RESC1005X40N]
R40  1k  R_402  [RESC1005X40N]
R41  10k  R_402  [RESC1005X40N]
R42  1k  R_402  [RESC1005X40N]
R43  10k  R_402  [RESC1005X40N]
R44  20k  R_402  [RESC1005X40N]
R45  0.01  R_603  [RESC1608X50AN]
R46  10k  R_402  [RESC1005X40N]
R47  33  R_402  [RESC1005X40N]
R48  10k  R_402  [RESC1005X40N]
R49  20k  R_402  [RESC1005X40N]
R50  1k  R_402  [RESC1005X40N]
R51  1k  R_402  [RESC1005X40N]
R52  0.01  R_603  [RESC1608X50AN]
R53  10k  R_402  [RESC1005X40N]
R54  1k  R_402  [RESC1005X40N]
R55  10k  R_402  [RESC1005X40N]
R56  20k  R_402  [RESC1005X40N]
R57  0.01  R_603  [RESC1608X50AN]
R58  100  R_402  [RESC1005X40N]
R59  10k  R_402  [RESC1005X40N]
R60  1k  R_402  [RESC1005X40N]
R61  100  R_402  [RESC1005X40N]
R62  100  R_402  [RESC1005X40N]
R63  10k  R_402  [RESC1005X40N]
R64  20k  R_402  [RESC1005X40N]
R65  0.01  R_603  [RESC1608X50AN]
R66  10k  R_402  [RESC1005X40N]
R67  1k  R_402  [RESC1005X40N]
R68  10k  R_402  [RESC1005X40N]
R69  20k  R_402  [RESC1005X40N]
R70  0.01  R_603  [RESC1608X50AN]
R71  100  R_402  [RESC1005X40N]
R72  100  R_402  [RESC1005X40N]
R73  100  R_402  [RESC1005X40N]
R74  10k  R_402  [RESC1005X40N]
R75  1k  R_402  [RESC1005X40N]
R76  10k  R_402  [RESC1005X40N]
R77  20k  R_402  [RESC1005X40N]
R78  0.01  R_603  [RESC1608X50AN]
R79  10k  R_402  [RESC1005X40N]
R80  33  R_402  [RESC1005X40N]
R81  10k  R_402  [RESC1005X40N]
R82  20k  R_402  [RESC1005X40N]
R83  0.01  R_603  [RESC1608X50AN]
R84  10k  R_402  [RESC1005X40N]
R85  33  R_402  [RESC1005X40N]
R86  10k  R_402  [RESC1005X40N]
R87  20k  R_402  [RESC1005X40N]
R88  0.01  R_603  [RESC1608X50AN]

### Nets
5V: C103.2 C109.2 C118.2 C125.2 CON18.4 CON19.5 CON20.2 CON22.2 CON23.2 CON25.2 CON26.4 CON27.5 CON28.2 CON30.2 CON31.4 CON32.5 CON33.2 CON35.2 CON37.2 CON39.2 CON40.6 CON41.5 CON42.2 CON44.2 CON45.6 CON46.2 CON48.2 CON49.5 CON50.2 CON52.2 CON53.5 R39.2 R40.2 R50.2 R51.2 ; also sheet 1,2,3,5,6,7
12V: CON36.4 ; also sheet 1
A5V: CON21.2 CON24.2 CON29.2 CON34.2 CON38.2 CON43.2 CON47.2 CON51.2 ; also sheet 1,3
AN0: C100.2 R41.2 R43.1 ; also sheet 6
AN1: C106.2 R46.2 R48.1 ; also sheet 6
AN2: C112.2 R53.2 R55.1 ; also sheet 6
AN3: C115.2 R59.2 R63.1 ; also sheet 6
AN4: C122.2 R66.2 R68.1 ; also sheet 6
AN5: C129.2 R74.2 R76.1 ; also sheet 6
AN6: C132.2 R79.2 R81.1 ; also sheet 6
AN7: C135.2 R84.2 R86.1 ; also sheet 6
BALISE°: CON36.5 ; also sheet 7
GND: C100.1 C101.1 C102.1 C103.1 C104.1 C105.1 C106.1 C107.1 C108.1 C109.1 C110.1 C111.1 C112.1 C113.1 C114.1 C115.1 C116.1 C117.1 C118.1 C119.1 C120.1 C121.1 C122.1 C123.1 C124.1 C125.1 C126.1 C127.1 C128.1 C129.1 C130.1 C131.1 C132.1 C133.1 C134.1 C135.1 C136.1 C137.1 CON18.1 CON19.1 CON19.4 CON20.1 CON22.1 CON23.1 CON25.1 CON26.1 CON27.1 CON27.4 CON28.1 CON30.1 CON31.1 CON32.1 CON33.1 CON35.1 CON36.1 CON37.1 CON39.1 CON40.1 CON41.1 CON42.1 CON44.1 CON45.1 CON46.1 CON48.1 CON49.1 CON50.1 CON52.1 CON53.1 R43.2 R45.P$2 R48.2 R52.P$2 R55.2 R57.P$2 R63.2 R65.P$2 R68.2 R70.P$2 R76.2 R78.P$2 R81.2 R83.P$2 R86.2 R88.P$2 ; also sheet 1,2,3,5,6,7,8
I2C0°: CON49.3 ; also sheet 7
I2C1°: CON53.3 ; also sheet 7
IO0°: C102.2 R42.2 ; also sheet 7
IO1°: C108.2 R47.2 ; also sheet 7
IO2°: C114.2 R54.2 ; also sheet 7
IO3°: C117.2 R60.2 ; also sheet 7
IO4°: C124.2 R67.2 ; also sheet 7
IO5°: C131.2 R75.2 ; also sheet 7
IO6°: C134.2 R80.2 ; also sheet 7
IO7°: C137.2 R85.2 ; also sheet 7
MISO0°: CON40.5 ; also sheet 7
MISO1°: CON45.5 ; also sheet 7
MOSI0°: CON40.4 ; also sheet 7
MOSI1°: CON45.4 ; also sheet 7
N$6: CON21.1 R44.2 R45.P$1
N$21: CON24.1 R49.2 R52.P$1
N$23: CON29.1 R56.2 R57.P$1
N$27: CON50.3 R84.1
N$28: CON20.3 R41.1
N$30: CON23.3 R46.1
N$32: CON28.3 R53.1
N$33: CON33.3 R59.1
N$34: CON37.3 R66.1
N$43: CON34.1 R64.2 R65.P$1
N$44: CON38.1 R69.2 R70.P$1
N$45: CON43.1 R77.2 R78.P$1
N$47: CON47.1 R82.2 R83.P$1
N$48: CON51.1 R87.2 R88.P$1
N$58: CON42.3 R74.1
N$59: CON46.3 R79.1
N$156: CON52.3 R85.1
N$158: CON22.3 R42.1
N$159: CON25.3 R47.1
N$160: CON30.3 R54.1
N$161: CON35.3 R60.1
N$162: CON39.3 R67.1
N$163: CON44.3 R75.1
N$164: CON48.3 R80.1
N$171: CON41.4 R71.2
N$172: CON41.3 R72.2
N$173: CON41.2 R73.2
N$174: CON32.4 R58.2
N$175: CON32.3 R61.2
N$176: CON32.2 R62.2
QEI0_A°: C111.2 CON27.2 R51.1 ; also sheet 7
QEI0_B°: C110.2 CON27.3 R50.1 ; also sheet 7
QEI1_A°: C105.2 CON19.2 R40.1 ; also sheet 7
QEI1_B°: C104.2 CON19.3 R39.1 ; also sheet 7
QEI2_A°: C128.2 R73.1 ; also sheet 7
QEI2_B°: C127.2 R72.1 ; also sheet 7
QEI2_Z°: C126.2 R71.1 ; also sheet 7
QEI3_A°: C121.2 R62.1 ; also sheet 7
QEI3_B°: C120.2 R61.1 ; also sheet 7
QEI3_Z°: C119.2 R58.1 ; also sheet 7
RX0°: CON18.2 ; also sheet 7
RX1°: CON26.2 ; also sheet 7
RX2°: CON31.2 ; also sheet 7
RX3°: CON36.2 ; also sheet 7
S0_CS: C101.2 R44.1 ; also sheet 6
S0°: CON21.3 ; also sheet 7
S1_CS: C107.2 R49.1 ; also sheet 6
S1°: CON24.3 ; also sheet 7
S2_CS: C113.2 R56.1 ; also sheet 6
S2°: CON29.3 ; also sheet 7
S3_CS: C116.2 R64.1 ; also sheet 6
S3°: CON34.3 ; also sheet 7
S4_CS: C123.2 R69.1 ; also sheet 6
S4°: CON38.3 ; also sheet 7
S5_CS: C130.2 R77.1 ; also sheet 6
S5°: CON43.3 ; also sheet 7
S6_CS: C133.2 R82.1 ; also sheet 6
S6°: CON47.3 ; also sheet 7
S7_CS: C136.2 R87.1 ; also sheet 6
S7°: CON51.3 ; also sheet 7
SCL0°: CON49.4 ; also sheet 7
SCL1°: CON53.4 ; also sheet 7
SCLK0°: CON40.2 ; also sheet 7
SCLK1°: CON45.2 ; also sheet 7
SDA0°: CON49.2 ; also sheet 7
SDA1°: CON53.2 ; also sheet 7
SS0°: CON40.3 ; also sheet 7
SS1°: CON45.3 ; also sheet 7
TELEM°: CON31.5 ; also sheet 7
TX0°: CON18.3 ; also sheet 7
TX1°: CON26.3 ; also sheet 7
TX2°: CON31.3 ; also sheet 7
TX3°: CON36.3 ; also sheet 7
Unconnected: CON18.5 CON26.5

### Notes on the sheet
- UARTs | MOTOR QEI | Manque des résistances de pull up
- ANALOG I/O | SERVOs | DIGITAL
- SPIs
- I2Cs
- PROJECT: EUROBOT 2017 - MOON VILLAGE
- BOARD : EXPANSION BOARD
- DESCRIPTION: | REV 0
- POWER SECTION AND ANALOG | AUTHOR : JEREMY S.
- DATE : 2016-30-10

## Sheet 5 of 8
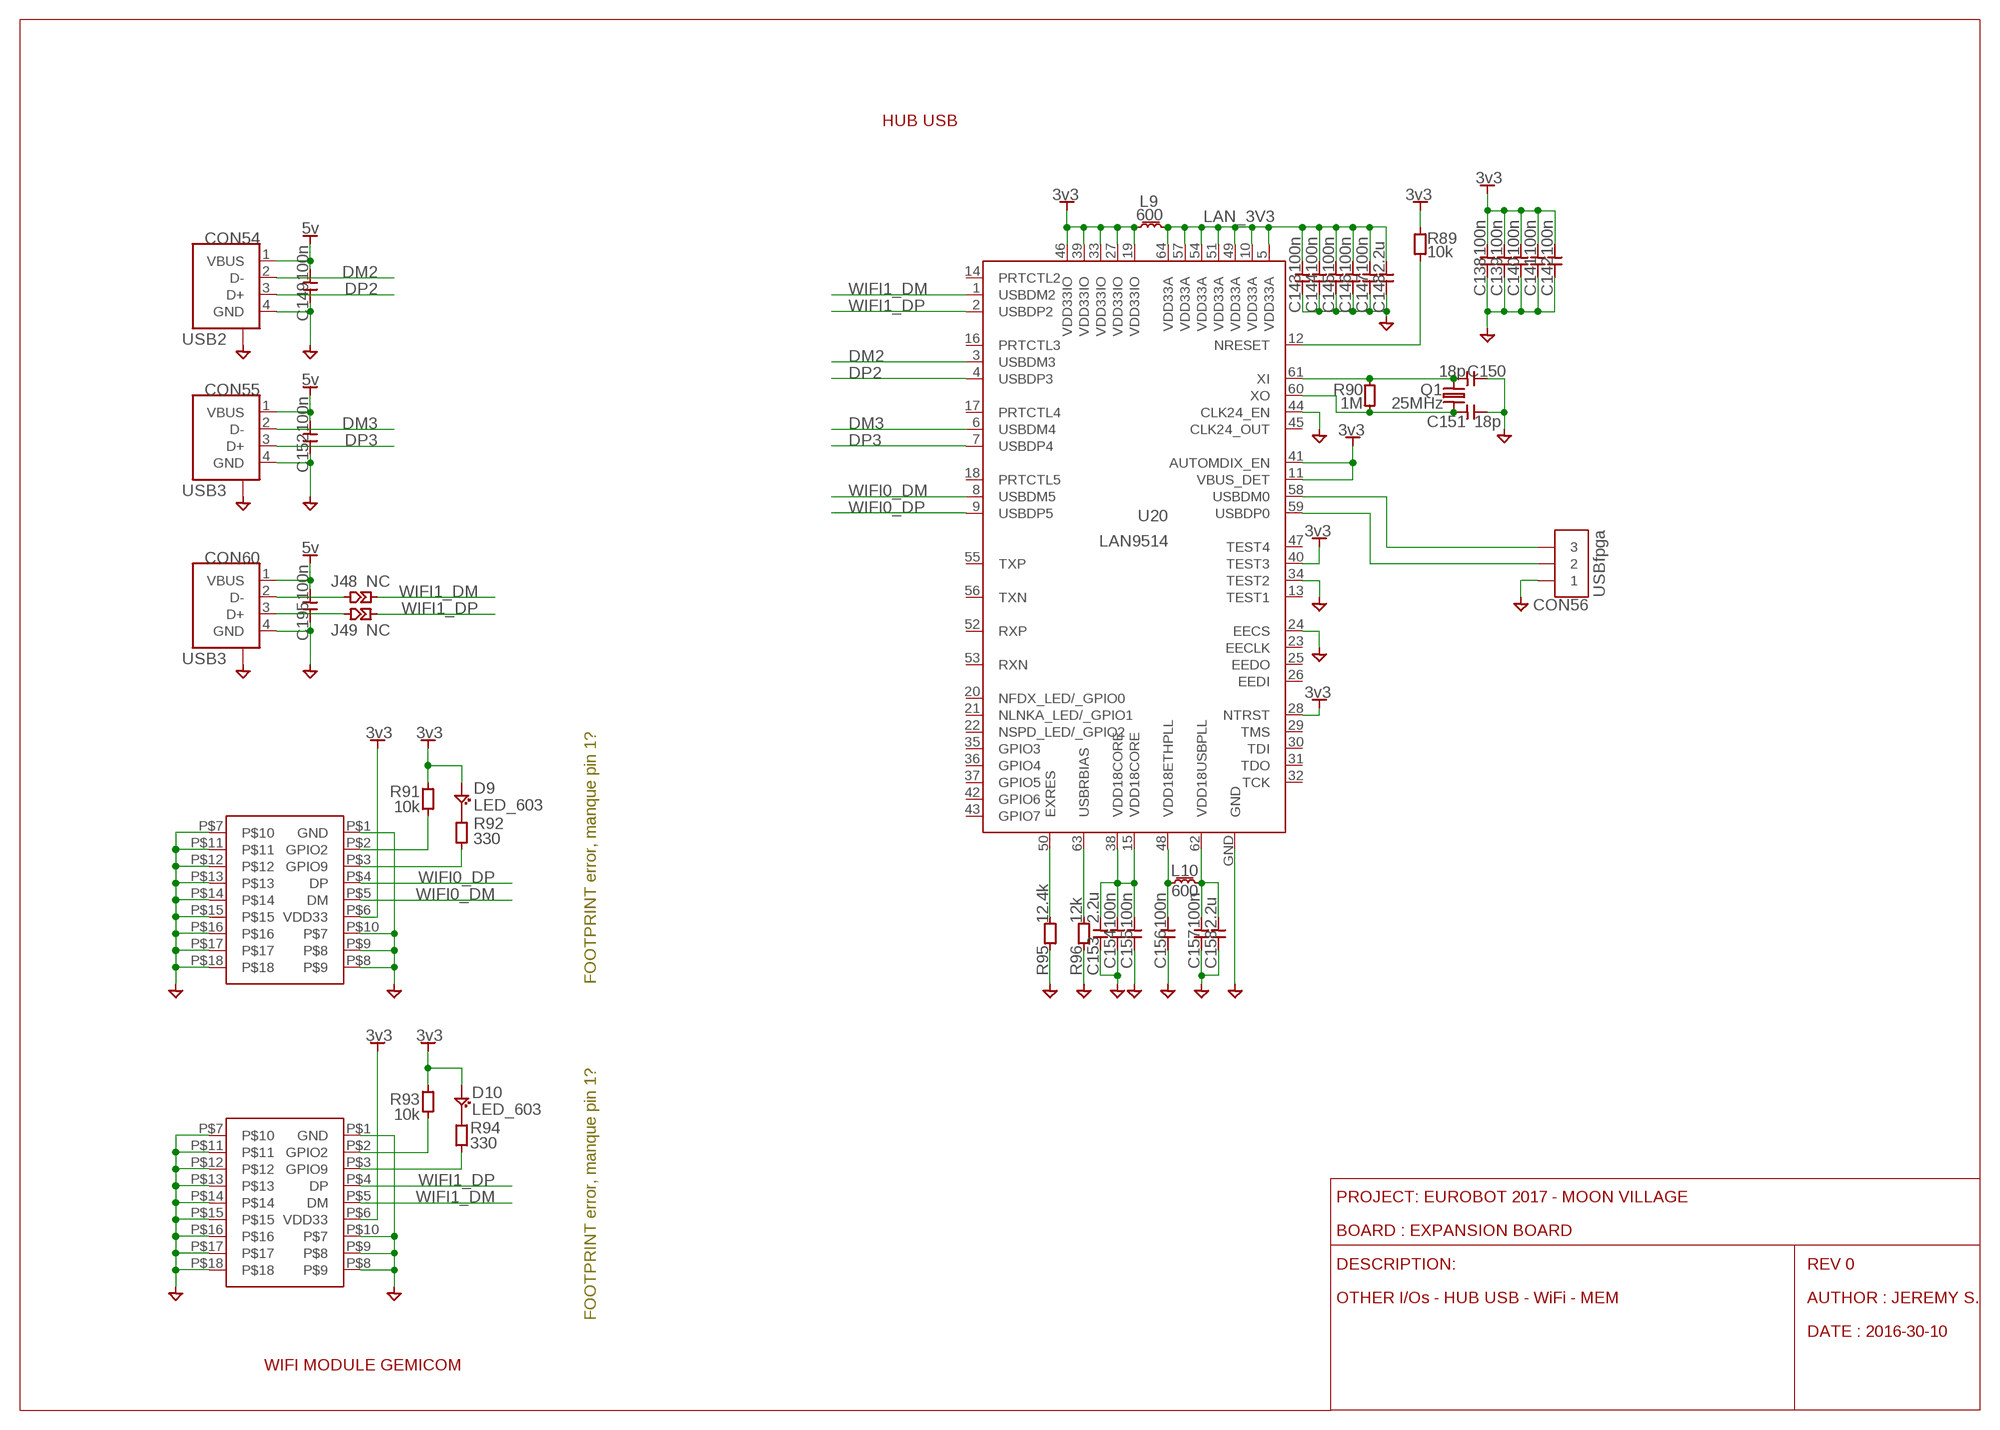
[diagram p4: schematic, sheet 5]

### Parts
C138  100n  C_402  [CAPC1005X55N]
C139  100n  C_402  [CAPC1005X55N]
C140  100n  C_402  [CAPC1005X55N]
C141  100n  C_402  [CAPC1005X55N]
C142  100n  C_402  [CAPC1005X55N]
C143  100n  C_402  [CAPC1005X55N]
C144  100n  C_402  [CAPC1005X55N]
C145  100n  C_402  [CAPC1005X55N]
C146  100n  C_402  [CAPC1005X55N]
C147  100n  C_402  [CAPC1005X55N]
C148  2.2u  C_603  [CAPC1608X95N]
C149  100n  C_402  [CAPC1005X55N]
C150  18p  C_402  [CAPC1005X55N]
C151  18p  C_402  [CAPC1005X55N]
C152  100n  C_402  [CAPC1005X55N]
C153  2.2u  C_603  [CAPC1608X95N]
C154  100n  C_402  [CAPC1005X55N]
C155  100n  C_402  [CAPC1005X55N]
C156  100n  C_402  [CAPC1005X55N]
C157  100n  C_402  [CAPC1005X55N]
C158  2.2u  C_603  [CAPC1608X95N]
C195  100n  C_402  [CAPC1005X55N]
CON54  USB2  USB_A  [USB_A]
CON55  USB3  USB_A  [USB_A]
CON56  USBfpga  CON3_2.54S  [CON254P762X400-3N-S]
CON60  USB3  USB_A  [USB_A]
D9  LED_603  [LEDC1608X60N]
D10  LED_603  [LEDC1608X60N]
J48  NC  JUMP_402  [JUMC1005X50N]
J49  NC  JUMP_402  [JUMC1005X50N]
L9  600  INDUCTANCE_603  [INDC1608X95N]
L10  600  INDUCTANCE_603  [INDC1608X95N]
Q1  25MHz  QUARTZ2  [XTAL500X320X130N]
R89  10k  R_402  [RESC1005X40N]
R90  1M  R_402  [RESC1005X40N]
R91  10k  R_402  [RESC1005X40N]
R92  330  R_402  [RESC1005X40N]
R93  10k  R_402  [RESC1005X40N]
R94  330  R_402  [RESC1005X40N]
R95  12.4k  R_402  [RESC1005X40N]
R96  12k  R_402  [RESC1005X40N]
U20  LAN9514  [QFN50P900X900X100-65N]
U21  LGA22U  [LGA22U]
U22  LGA22U  [LGA22U]

### Nets
3V3: C138.2 C139.2 C140.2 C141.2 C142.2 D9.A D10.A L9.1 R89.2 R91.2 R93.2 U20.11(VBUS_DET) U20.19(VDD33IO) U20.27(VDD33IO) U20.28(NTRST) U20.33(VDD33IO) U20.39(VDD33IO) U20.40(TEST3) U20.41(AUTOMDIX_EN) U20.46(VDD33IO) U21.P$6(VDD33) U22.P$6(VDD33) ; also sheet 1
5V: C149.2 C152.2 C195.2 CON54.1(VBUS) CON55.1(VBUS) CON60.1(VBUS) ; also sheet 1,2,3,4,6,7
DM2: CON54.2(D-) U20.3(USBDM3)
DM3: CON55.2(D-) U20.6(USBDM4)
DP2: CON54.3(D+) U20.4(USBDP3)
DP3: CON55.3(D+) U20.7(USBDP4)
GND: C138.1 C139.1 C140.1 C141.1 C142.1 C143.1 C144.1 C145.1 C146.1 C147.1 C148.P$1 C149.1 C150.1 C151.1 C152.1 C153.P$1 C154.1 C155.1 C156.1 C157.1 C158.P$1 C195.1 CON54.4(GND) CON54.GND1(GND) CON54.GND2(GND) CON55.4(GND) CON55.GND1(GND) CON55.GND2(GND) CON56.1 CON60.4(GND) CON60.GND1(GND) CON60.GND2(GND) R95.1 R96.1 U20.24(EECS) U20.34(TEST2) U20.44(CLK24_EN) U20.GND U21.P$1(GND) U21.P$7 U21.P$8 U21.P$9 U21.P$10 U21.P$11 U21.P$12 U21.P$13 U21.P$14 U21.P$15 U21.P$16 U21.P$17 U21.P$18 U22.P$1(GND) U22.P$7 U22.P$8 U22.P$9 U22.P$10 U22.P$11 U22.P$12 U22.P$13 U22.P$14 U22.P$15 U22.P$16 U22.P$17 U22.P$18 ; also sheet 1,2,3,4,6,7,8
LAN_3V3: C143.2 C144.2 C145.2 C146.2 C147.2 C148.P$2 L9.2 U20.5(VDD33A) U20.10(VDD33A) U20.49(VDD33A) U20.51(VDD33A) U20.54(VDD33A) U20.57(VDD33A) U20.64(VDD33A)
N$2: CON60.2(D-) J48.P$1
N$24: CON60.3(D+) J49.P$1
N$66: D10.C R94.2
N$67: D9.C R92.2
N$110: C157.2 C158.P$2 L10.2 U20.62(VDD18USBPLL)
N$111: C153.P$2 C154.2 C155.2 U20.15(VDD18CORE) U20.38(VDD18CORE)
N$112: C156.2 L10.1 U20.48(VDD18ETHPLL)
N$113: R95.2 U20.50(EXRES)
N$149: R96.2 U20.63(USBRBIAS)
N$150: C151.2 Q1.2 R90.1 U20.60(XO)
N$151: CON56.2 U20.59(USBDP0)
N$153: CON56.3 U20.58(USBDM0)
N$154: R89.1 U20.12(NRESET)
N$155: C150.2 Q1.1 R90.2 U20.61(XI)
WIFI0_DM: U20.8(USBDM5) U21.P$5(DM)
WIFI0_DP: U20.9(USBDP5) U21.P$4(DP)
WIFI1_DM: J48.P$2 U20.1(USBDM2) U22.P$5(DM)
WIFI1_DP: J49.P$2 U20.2(USBDP2) U22.P$4(DP)
WIFI1_LED: R94.1 U22.P$3(GPIO9)
WIFI1_LED1: R92.1 U21.P$3(GPIO9)
WIFI1_WPS: R93.1 U22.P$2(GPIO2)
WIFI1_WPS1: R91.1 U21.P$2(GPIO2)
Unconnected: U20.13(TEST1) U20.14(PRTCTL2) U20.16(PRTCTL3) U20.17(PRTCTL4) U20.18(PRTCTL5) U20.20(NFDX_LED/_GPIO0) U20.21(NLNKA_LED/_GPIO1) U20.22(NSPD_LED/_GPIO2) U20.23(EECLK) U20.25(EEDO) U20.26(EEDI) U20.29(TMS) U20.30(TDI) U20.31(TDO) U20.32(TCK) U20.35(GPIO3) U20.36(GPIO4) U20.37(GPIO5) U20.42(GPIO6) U20.43(GPIO7) U20.45(CLK24_OUT) U20.47(TEST4) U20.52(RXP) U20.53(RXN) U20.55(TXP) U20.56(TXN)

### Notes on the sheet
- HUB USB
- FOOTPRINT error, manque pin 1?
- PROJECT: EUROBOT 2017 - MOON VILLAGE
- BOARD : EXPANSION BOARD
- DESCRIPTION: | REV 0
- OTHER I/Os - HUB USB - WiFi - MEM | AUTHOR : JEREMY S.
- FOOTPRINT error, manque pin 1?
- DATE : 2016-30-10
- WIFI MODULE GEMICOM

## Sheet 6 of 8
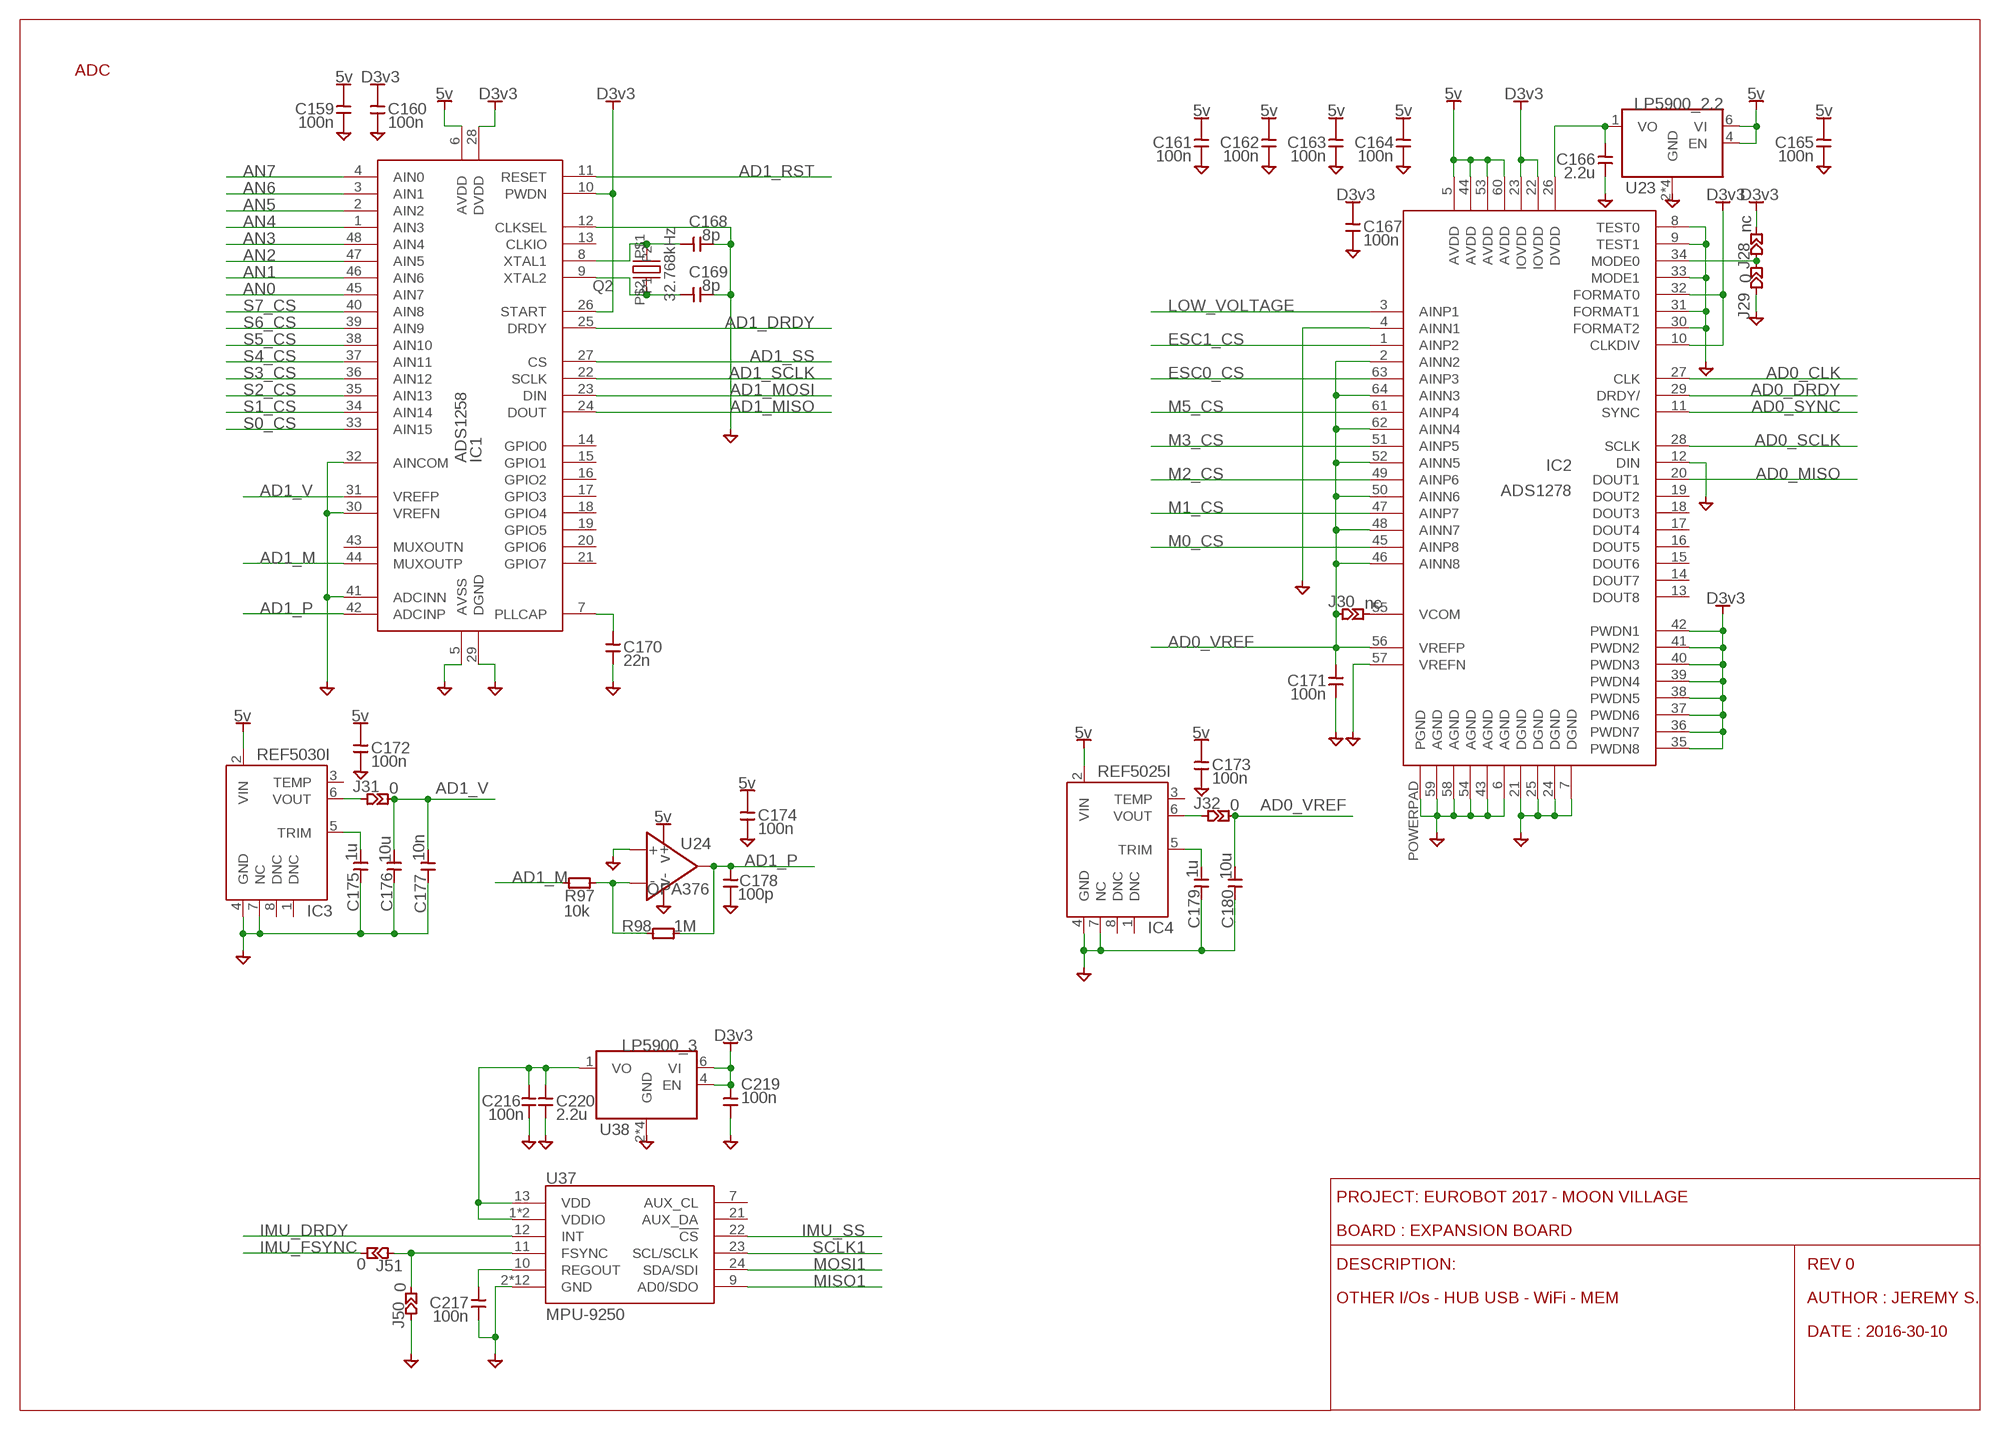
[diagram p5: schematic, sheet 6]

### Parts
C159  100n  C_402  [CAPC1005X55N]
C160  100n  C_402  [CAPC1005X55N]
C161  100n  C_402  [CAPC1005X55N]
C162  100n  C_402  [CAPC1005X55N]
C163  100n  C_402  [CAPC1005X55N]
C164  100n  C_402  [CAPC1005X55N]
C165  100n  C_402  [CAPC1005X55N]
C166  2.2u  C_603  [CAPC1608X95N]
C167  100n  C_402  [CAPC1005X55N]
C168  8p  C_402  [CAPC1005X55N]
C169  8p  C_402  [CAPC1005X55N]
C170  22n  C_402  [CAPC1005X55N]
C171  100n  C_402  [CAPC1005X55N]
C172  100n  C_402  [CAPC1005X55N]
C173  100n  C_402  [CAPC1005X55N]
C174  100n  C_402  [CAPC1005X55N]
C175  1u  C_603  [CAPC1608X95N]
C176  10u  C_805  [CAPC2013X100N]
C177  10n  C_402  [CAPC1005X55N]
C178  100p  C_402  [CAPC1005X55N]
C179  1u  C_603  [CAPC1608X95N]
C180  10u  C_805  [CAPC2013X100N]
C216  100n  C_402  [CAPC1005X55N]
C217  100n  C_402  [CAPC1005X55N]
C219  100n  C_402  [CAPC1005X55N]
C220  2.2u  C_603  [CAPC1608X95N]
IC1  ADS1258  [QFN48]
IC2  ADS1278  ADS1278"  [TQFP64_POWERPAD]
IC3  REF5030I  REF5025I  [MSOP8_0.65]
IC4  REF5025I  [MSOP8_0.65]
J28  nc  JUMP_402  [JUMC1005X50N]
J29  0  JUMP_402  [JUMC1005X50N]
J30  nc  JUMP_402  [JUMC1005X50N]
J31  0  JUMP_402  [JUMC1005X50N]
J32  0  JUMP_402  [JUMC1005X50N]
J50  0  JUMP_402  [JUMC1005X50N]
J51  0  JUMP_402  [JUMC1005X50N]
Q2  32.768kHz  QUARTZ_1206  [1206]
R97  10k  R_402  [RESC1005X40N]
R98  1M  R_402  [RESC1005X40N]
U23  LP5900_2.2  REG_EN_LP5900  [SON65P250X220X80-7N]
U24  OPA376  [SC70-5N]
U37  MPU-9250  [QFN24-3X3]
U38  LP5900_3  REG_EN_LP5900  [SON65P250X220X80-7N]

### Nets
5V: C159.2 C161.2 C162.2 C163.2 C164.2 C165.2 C172.2 C173.2 C174.2 IC1.6(AVDD) IC2.5(AVDD) IC2.44(AVDD) IC2.53(AVDD) IC2.60(AVDD) IC3.2(VIN) IC4.2(VIN) U23.4(EN) U23.6(VI) U24.P$5(VCC) ; also sheet 1,2,3,4,5,7
AD0_CLK: IC2.27(CLK) ; also sheet 7
AD0_DRDY: IC2.29(DRDY/) ; also sheet 7
AD0_MISO: IC2.20(DOUT1) ; also sheet 7
AD0_SCLK: IC2.28(SCLK) ; also sheet 7
AD0_SYNC: IC2.11(SYNC) ; also sheet 7
AD0_VREF: C171.2 C180.P$1 IC2.2(AINN2) IC2.46(AINN8) IC2.48(AINN7) IC2.50(AINN6) IC2.52(AINN5) IC2.56(VREFP) IC2.62(AINN4) IC2.64(AINN3) J30.P$1 J32.P$2 ; also sheet 2,3
AD1_DRDY: IC1.25(DRDY) ; also sheet 7
AD1_M: IC1.44(MUXOUTP) R97.1
AD1_MISO: IC1.24(DOUT) ; also sheet 7
AD1_MOSI: IC1.23(DIN) ; also sheet 7
AD1_P: C178.2 IC1.42(ADCINP) R98.2 U24.P$4(OUT)
AD1_RST: IC1.11(RESET) ; also sheet 7
AD1_SCLK: IC1.22(SCLK) ; also sheet 7
AD1_SS: IC1.27(CS) ; also sheet 7
AD1_V: C176.P$1 C177.2 IC1.31(VREFP) J31.P$2
AN0: IC1.45(AIN7) ; also sheet 4
AN1: IC1.46(AIN6) ; also sheet 4
AN2: IC1.47(AIN5) ; also sheet 4
AN3: IC1.48(AIN4) ; also sheet 4
AN4: IC1.1(AIN3) ; also sheet 4
AN5: IC1.2(AIN2) ; also sheet 4
AN6: IC1.3(AIN1) ; also sheet 4
AN7: IC1.4(AIN0) ; also sheet 4
D3V3: C160.2 C167.2 C219.2 IC1.10(PWDN) IC1.26(START) IC1.28(DVDD) IC2.10(CLKDIV) IC2.22(IOVDD) IC2.23(IOVDD) IC2.32(FORMAT0) IC2.35(PWDN8) IC2.36(PWDN7) IC2.37(PWDN6) IC2.38(PWDN5) IC2.39(PWDN4) IC2.40(PWDN3) IC2.41(PWDN2) IC2.42(PWDN1) J28.P$2 U38.4(EN) U38.6(VI) ; also sheet 1,7
ESC0_CS: IC2.63(AINP3) ; also sheet 3
ESC1_CS: IC2.1(AINP2) ; also sheet 3
GND: C159.1 C160.1 C161.1 C162.1 C163.1 C164.1 C165.1 C166.P$1 C167.1 C168.1 C169.1 C170.1 C171.1 C172.1 C173.1 C174.1 C175.P$2 C176.P$2 C177.1 C178.1 C179.P$2 C180.P$2 C216.1 C217.1 C219.1 C220.P$1 IC1.5(AVSS) IC1.12(CLKSEL) IC1.29(DGND) IC1.30(VREFN) IC1.32(AINCOM) IC1.41(ADCINN) IC2.4(AINN1) IC2.6(AGND) IC2.7(DGND) IC2.8(TEST0) IC2.9(TEST1) IC2.12(DIN) IC2.21(DGND) IC2.24(DGND) IC2.25(DGND) IC2.30(FORMAT2) IC2.31(FORMAT1) IC2.33(MODE1) IC2.43(AGND) IC2.54(AGND) IC2.57(VREFN) IC2.58(AGND) IC2.59(AGND) IC2.POWERPAD(PGND) IC3.4(GND) IC3.7(NC) IC4.4(GND) IC4.7(NC) J29.P$1 J50.P$1 U23.2(GND) U23.3(GND) U23.5(GND) U23.GND U24.P$1(+) U24.P$2(GND) U37.2(GND) U37.3(GND) U37.4(GND) U37.5(GND) U37.6(GND) U37.14(GND) U37.15(GND) U37.16(GND) U37.17(GND) U37.18(GND) U37.20(GND) U37.PAD(GND) U38.2(GND) U38.3(GND) U38.5(GND) U38.GND ; also sheet 1,2,3,4,5,7,8
IMU_DRDY: U37.12(INT) ; also sheet 7
IMU_FSYNC: J51.P$2 ; also sheet 7
IMU_SS: U37.22(!CS) ; also sheet 7
LOW_VOLTAGE: IC2.3(AINP1) ; also sheet 1
M0_CS: IC2.45(AINP8) ; also sheet 2
M1_CS: IC2.47(AINP7) ; also sheet 2
M2_CS: IC2.49(AINP6) ; also sheet 2
M3_CS: IC2.51(AINP5) ; also sheet 2
M5_CS: IC2.61(AINP4) ; also sheet 2
MISO1: U37.9(AD0/SDO) ; also sheet 7
MOSI1: U37.24(SDA/SDI) ; also sheet 7
N$25: R97.2 R98.1 U24.P$3(-)
N$49: C168.2 IC1.8(XTAL1) Q2.P$1(P1)
N$50: C175.P$1 IC3.5(TRIM)
N$51: IC3.6(VOUT) J31.P$1
N$53: C170.2 IC1.7(PLLCAP)
N$54: C169.2 IC1.9(XTAL2) Q2.P$2(P2)
N$74: C216.2 C220.P$2 U37.1(VDDIO) U37.8(VDDIO) U37.13(VDD) U38.1(VO)
N$98: J50.P$2 J51.P$1 U37.11(FSYNC)
N$166: IC2.55(VCOM) J30.P$2
N$167: IC2.34(MODE0) J28.P$1 J29.P$2
N$168: C179.P$1 IC4.5(TRIM)
N$169: C166.P$2 IC2.26(DVDD) U23.1(VO)
N$170: IC4.6(VOUT) J32.P$1
REGOUT1: C217.2 U37.10(REGOUT)
S0_CS: IC1.33(AIN15) ; also sheet 4
S1_CS: IC1.34(AIN14) ; also sheet 4
S2_CS: IC1.35(AIN13) ; also sheet 4
S3_CS: IC1.36(AIN12) ; also sheet 4
S4_CS: IC1.37(AIN11) ; also sheet 4
S5_CS: IC1.38(AIN10) ; also sheet 4
S6_CS: IC1.39(AIN9) ; also sheet 4
S7_CS: IC1.40(AIN8) ; also sheet 4
SCLK1: U37.23(SCL/SCLK) ; also sheet 7
Unconnected: IC1.13(CLKIO) IC1.14(GPIO0) IC1.15(GPIO1) IC1.16(GPIO2) IC1.17(GPIO3) IC1.18(GPIO4) IC1.19(GPIO5) IC1.20(GPIO6) IC1.21(GPIO7) IC1.43(MUXOUTN) IC2.13(DOUT8) IC2.14(DOUT7) IC2.15(DOUT6) IC2.16(DOUT5) IC2.17(DOUT4) IC2.18(DOUT3) IC2.19(DOUT2) IC3.1(DNC) IC3.3(TEMP) IC3.8(DNC) IC4.1(DNC) IC4.3(TEMP) IC4.8(DNC) U37.7(AUX_CL) U37.21(AUX_DA)

### Notes on the sheet
- ADC
- PROJECT: EUROBOT 2017 - MOON VILLAGE
- BOARD : EXPANSION BOARD
- DESCRIPTION: | REV 0
- OTHER I/Os - HUB USB - WiFi - MEM | AUTHOR : JEREMY S.
- DATE : 2016-30-10

## Sheet 7 of 8
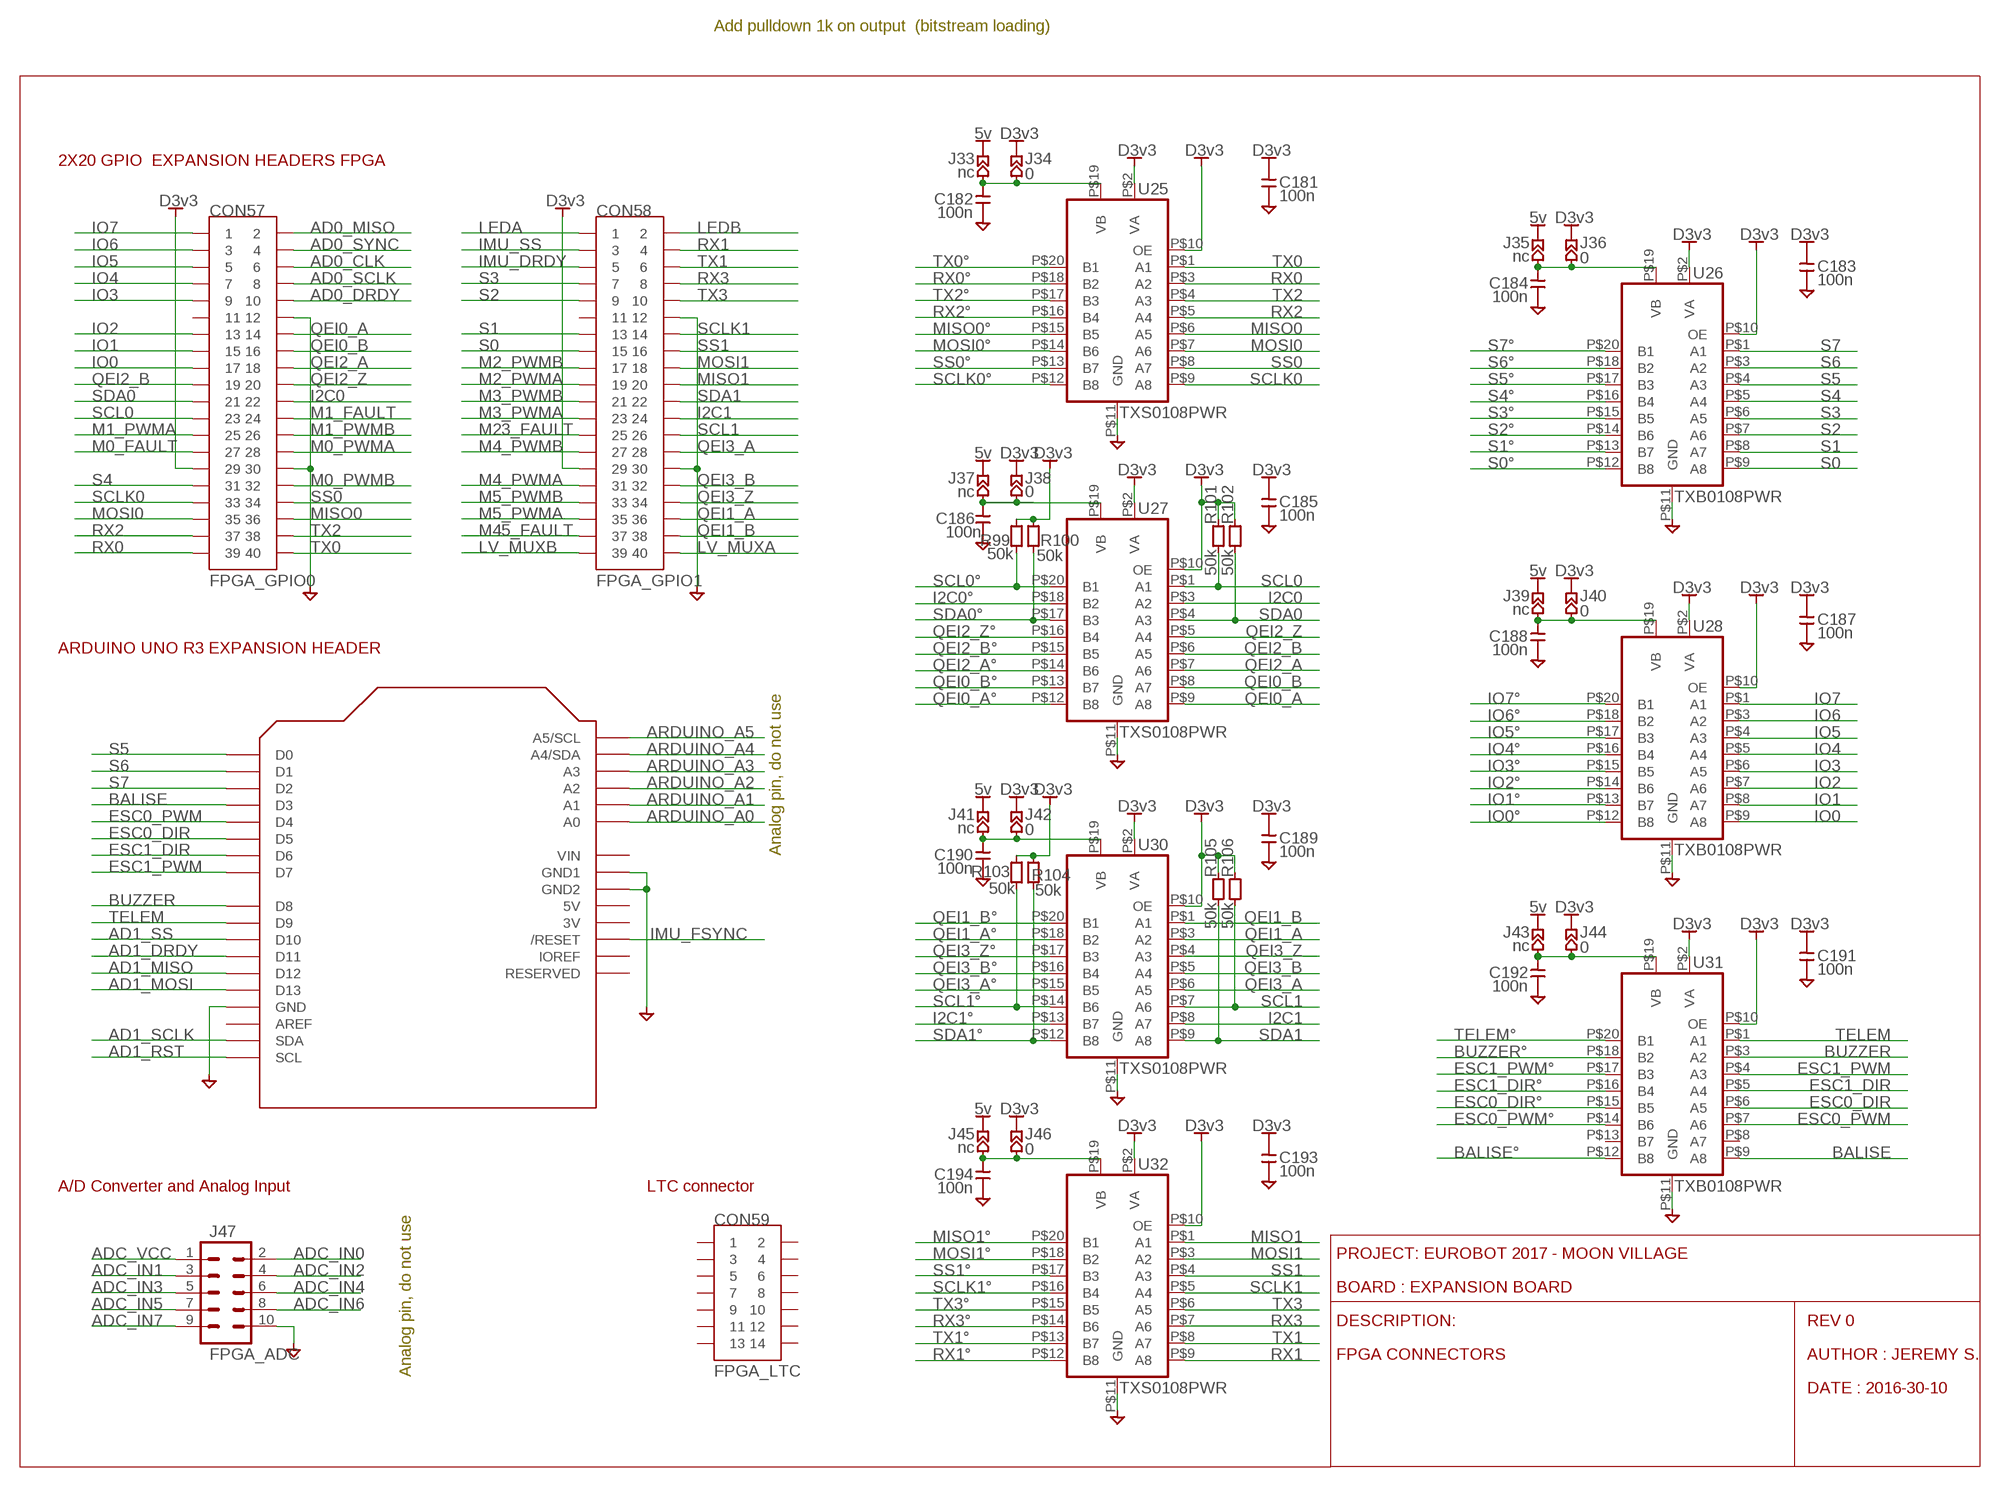
[diagram p6: schematic, sheet 7]

### Parts
C181  100n  C_402  [CAPC1005X55N]
C182  100n  C_402  [CAPC1005X55N]
C183  100n  C_402  [CAPC1005X55N]
C184  100n  C_402  [CAPC1005X55N]
C185  100n  C_402  [CAPC1005X55N]
C186  100n  C_402  [CAPC1005X55N]
C187  100n  C_402  [CAPC1005X55N]
C188  100n  C_402  [CAPC1005X55N]
C189  100n  C_402  [CAPC1005X55N]
C190  100n  C_402  [CAPC1005X55N]
C191  100n  C_402  [CAPC1005X55N]
C192  100n  C_402  [CAPC1005X55N]
C193  100n  C_402  [CAPC1005X55N]
C194  100n  C_402  [CAPC1005X55N]
CON57  FPGA_GPIO0  CON40_2.54  [CON254P5080X600-40N]
CON58  FPGA_GPIO1  CON40_2.54  [CON254P5080X600-40N]
CON59  FPGA_LTC  CON14  [CON200P1700X400-2X7N]
J33  nc  JUMP_402  [JUMC1005X50N]
J34  0  JUMP_402  [JUMC1005X50N]
J35  nc  JUMP_402  [JUMC1005X50N]
J36  0  JUMP_402  [JUMC1005X50N]
J37  nc  JUMP_402  [JUMC1005X50N]
J38  0  JUMP_402  [JUMC1005X50N]
J39  nc  JUMP_402  [JUMC1005X50N]
J40  0  JUMP_402  [JUMC1005X50N]
J41  nc  JUMP_402  [JUMC1005X50N]
J42  0  JUMP_402  [JUMC1005X50N]
J43  nc  JUMP_402  [JUMC1005X50N]
J44  0  JUMP_402  [JUMC1005X50N]
J45  nc  JUMP_402  [JUMC1005X50N]
J46  0  JUMP_402  [JUMC1005X50N]
J47  FPGA_ADC  M05X2NO_SILK  [2X5_NOSILK]
R99  50k  R_402  [RESC1005X40N]
R100  50k  R_402  [RESC1005X40N]
R101  50k  R_402  [RESC1005X40N]
R102  50k  R_402  [RESC1005X40N]
R103  50k  R_402  [RESC1005X40N]
R104  50k  R_402  [RESC1005X40N]
R105  50k  R_402  [RESC1005X40N]
R106  50k  R_402  [RESC1005X40N]
U25  TXS0108PWR  TX_0108_TSSOP  [SOP65P640X110-20N]
U26  TXB0108PWR  TX_0108_TSSOP  [SOP65P640X110-20N]
U27  TXS0108PWR  TX_0108_TSSOP  [SOP65P640X110-20N]
U28  TXB0108PWR  TX_0108_TSSOP  [SOP65P640X110-20N]
U29  FPGA_ARDUINO  ARDUINOR3-DIMENSION  [ARDUINOR3]
U30  TXS0108PWR  TX_0108_TSSOP  [SOP65P640X110-20N]
U31  TXB0108PWR  TX_0108_TSSOP  [SOP65P640X110-20N]
U32  TXS0108PWR  TX_0108_TSSOP  [SOP65P640X110-20N]

### Nets
5V: J33.P$2 J35.P$2 J37.P$2 J39.P$2 J41.P$2 J43.P$2 J45.P$2 ; also sheet 1,2,3,4,5,6
AD0_CLK: CON57.6 ; also sheet 6
AD0_DRDY: CON57.10 ; also sheet 6
AD0_MISO: CON57.2 ; also sheet 6
AD0_SCLK: CON57.8 ; also sheet 6
AD0_SYNC: CON57.4 ; also sheet 6
AD1_DRDY: U29.D11 ; also sheet 6
AD1_MISO: U29.D12 ; also sheet 6
AD1_MOSI: U29.D13 ; also sheet 6
AD1_RST: U29.SCL ; also sheet 6
AD1_SCLK: U29.SDA ; also sheet 6
AD1_SS: U29.D10 ; also sheet 6
ADC_IN0: J47.2
ADC_IN1: J47.3
ADC_IN2: J47.4
ADC_IN3: J47.5
ADC_IN4: J47.6
ADC_IN5: J47.7
ADC_IN6: J47.8
ADC_IN7: J47.9
ADC_VCC: J47.1
ARDUINO_A0: U29.A0
ARDUINO_A1: U29.A1
ARDUINO_A2: U29.A2
ARDUINO_A3: U29.A3
ARDUINO_A4: U29.A4(A4/SDA)
ARDUINO_A5: U29.A5(A5/SCL)
BALISE: U29.D3 U31.P$9(A8)
BALISE°: U31.P$12(B8) ; also sheet 4
BUZZER: U29.D8 U31.P$3(A2)
BUZZER°: U31.P$18(B2) ; also sheet 1
D3V3: C181.2 C183.2 C185.2 C187.2 C189.2 C191.2 C193.2 CON57.29 CON58.29 J34.P$2 J36.P$2 J38.P$2 J40.P$2 J42.P$2 J44.P$2 J46.P$2 R99.2 R100.2 R101.2 R102.2 R103.2 R104.2 R105.2 R106.2 U25.P$2(VA) U25.P$10(OE) U26.P$2(VA) U26.P$10(OE) U27.P$2(VA) U27.P$10(OE) U28.P$2(VA) U28.P$10(OE) U30.P$2(VA) U30.P$10(OE) U31.P$2(VA) U31.P$10(OE) U32.P$2(VA) U32.P$10(OE) ; also sheet 1,6
ESC0_DIR: U29.D5 U31.P$6(A5)
ESC0_DIR°: U31.P$15(B5) ; also sheet 3
ESC0_PWM: U29.D4 U31.P$7(A6)
ESC0_PWM°: U31.P$14(B6) ; also sheet 3
ESC1_DIR: U29.D6 U31.P$5(A4)
ESC1_DIR°: U31.P$16(B4) ; also sheet 3
ESC1_PWM: U29.D7 U31.P$4(A3)
ESC1_PWM°: U31.P$17(B3) ; also sheet 3
GND: C181.1 C182.1 C183.1 C184.1 C185.1 C186.1 C187.1 C188.1 C189.1 C190.1 C191.1 C192.1 C193.1 C194.1 CON57.12 CON57.30 CON58.12 CON58.30 J47.10 U25.P$11(GND) U26.P$11(GND) U27.P$11(GND) U28.P$11(GND) U29.GND U29.GND1 U29.GND2 U30.P$11(GND) U31.P$11(GND) U32.P$11(GND) ; also sheet 1,2,3,4,5,6,8
I2C0: CON57.22 U27.P$3(A2)
I2C0°: U27.P$18(B2) ; also sheet 4
I2C1: CON58.24 U30.P$8(A7)
I2C1°: U30.P$13(B7) ; also sheet 4
IMU_DRDY: CON58.5 ; also sheet 6
IMU_FSYNC: U29.RESET(/RESET) ; also sheet 6
IMU_SS: CON58.3 ; also sheet 6
IO0: CON57.17 U28.P$9(A8)
IO0°: U28.P$12(B8) ; also sheet 4
IO1: CON57.15 U28.P$8(A7)
IO1°: U28.P$13(B7) ; also sheet 4
IO2: CON57.13 U28.P$7(A6)
IO2°: U28.P$14(B6) ; also sheet 4
IO3: CON57.9 U28.P$6(A5)
IO3°: U28.P$15(B5) ; also sheet 4
IO4: CON57.7 U28.P$5(A4)
IO4°: U28.P$16(B4) ; also sheet 4
IO5: CON57.5 U28.P$4(A3)
IO5°: U28.P$17(B3) ; also sheet 4
IO6: CON57.3 U28.P$3(A2)
IO6°: U28.P$18(B2) ; also sheet 4
IO7: CON57.1 U28.P$1(A1)
IO7°: U28.P$20(B1) ; also sheet 4
LEDA: CON58.1 ; also sheet 1
LEDB: CON58.2 ; also sheet 1
LV_MUXA: CON58.40 ; also sheet 1
LV_MUXB: CON58.39 ; also sheet 1
M0_FAULT: CON57.27 ; also sheet 2
M0_PWMA: CON57.28 ; also sheet 2
M0_PWMB: CON57.32 ; also sheet 2
M1_FAULT: CON57.24 ; also sheet 2
M1_PWMA: CON57.25 ; also sheet 2
M1_PWMB: CON57.26 ; also sheet 2
M2_PWMA: CON58.19 ; also sheet 2
M2_PWMB: CON58.17 ; also sheet 2
M3_PWMA: CON58.23 ; also sheet 2
M3_PWMB: CON58.21 ; also sheet 2
M4_PWMA: CON58.31 ; also sheet 2
M4_PWMB: CON58.27 ; also sheet 2
M5_PWMA: CON58.35 ; also sheet 2
M5_PWMB: CON58.33 ; also sheet 2
M23_FAULT: CON58.25 ; also sheet 2
M45_FAULT: CON58.37 ; also sheet 2
MISO0: CON57.36 U25.P$6(A5)
MISO0°: U25.P$15(B5) ; also sheet 4
MISO1: CON58.20 U32.P$1(A1) ; also sheet 6
MISO1°: U32.P$20(B1) ; also sheet 4
MOSI0: CON57.35 U25.P$7(A6)
MOSI0°: U25.P$14(B6) ; also sheet 4
MOSI1: CON58.18 U32.P$3(A2) ; also sheet 6
MOSI1°: U32.P$18(B2) ; also sheet 4
N$31: C182.2 J33.P$1 J34.P$1 U25.P$19(VB)
N$35: C186.2 J37.P$1 J38.P$1 U27.P$19(VB)
N$36: C190.2 J41.P$1 J42.P$1 U30.P$19(VB)
N$37: C194.2 J45.P$1 J46.P$1 U32.P$19(VB)
N$38: C184.2 J35.P$1 J36.P$1 U26.P$19(VB)
N$39: C188.2 J39.P$1 J40.P$1 U28.P$19(VB)
N$40: C192.2 J43.P$1 J44.P$1 U31.P$19(VB)
QEI0_A: CON57.14 U27.P$9(A8)
QEI0_A°: U27.P$12(B8) ; also sheet 4
QEI0_B: CON57.16 U27.P$8(A7)
QEI0_B°: U27.P$13(B7) ; also sheet 4
QEI1_A: CON58.36 U30.P$3(A2)
QEI1_A°: U30.P$18(B2) ; also sheet 4
QEI1_B: CON58.38 U30.P$1(A1)
QEI1_B°: U30.P$20(B1) ; also sheet 4
QEI2_A: CON57.18 U27.P$7(A6)
QEI2_A°: U27.P$14(B6) ; also sheet 4
QEI2_B: CON57.19 U27.P$6(A5)
QEI2_B°: U27.P$15(B5) ; also sheet 4
QEI2_Z: CON57.20 U27.P$5(A4)
QEI2_Z°: U27.P$16(B4) ; also sheet 4
QEI3_A: CON58.28 U30.P$6(A5)
QEI3_A°: U30.P$15(B5) ; also sheet 4
QEI3_B: CON58.32 U30.P$5(A4)
QEI3_B°: U30.P$16(B4) ; also sheet 4
QEI3_Z: CON58.34 U30.P$4(A3)
QEI3_Z°: U30.P$17(B3) ; also sheet 4
RX0: CON57.39 U25.P$3(A2)
RX0°: U25.P$18(B2) ; also sheet 4
RX1: CON58.4 U32.P$9(A8)
RX1°: U32.P$12(B8) ; also sheet 4
RX2: CON57.37 U25.P$5(A4)
RX2°: U25.P$16(B4) ; also sheet 4
RX3: CON58.8 U32.P$7(A6)
RX3°: U32.P$14(B6) ; also sheet 4
S0: CON58.15 U26.P$9(A8)
S0°: U26.P$12(B8) ; also sheet 4
S1: CON58.13 U26.P$8(A7)
S1°: U26.P$13(B7) ; also sheet 4
S2: CON58.9 U26.P$7(A6)
S2°: U26.P$14(B6) ; also sheet 4
S3: CON58.7 U26.P$6(A5)
S3°: U26.P$15(B5) ; also sheet 4
S4: CON57.31 U26.P$5(A4)
S4°: U26.P$16(B4) ; also sheet 4
S5: U26.P$4(A3) U29.D0
S5°: U26.P$17(B3) ; also sheet 4
S6: U26.P$3(A2) U29.D1
S6°: U26.P$18(B2) ; also sheet 4
S7: U26.P$1(A1) U29.D2
S7°: U26.P$20(B1) ; also sheet 4
SCL0: CON57.23 R101.1 U27.P$1(A1)
SCL0°: R99.1 U27.P$20(B1) ; also sheet 4
SCL1: CON58.26 R106.1 U30.P$7(A6)
SCL1°: R103.1 U30.P$14(B6) ; also sheet 4
SCLK0: CON57.33 U25.P$9(A8)
SCLK0°: U25.P$12(B8) ; also sheet 4
SCLK1: CON58.14 U32.P$5(A4) ; also sheet 6
SCLK1°: U32.P$16(B4) ; also sheet 4
SDA0: CON57.21 R102.1 U27.P$4(A3)
SDA0°: R100.1 U27.P$17(B3) ; also sheet 4
SDA1: CON58.22 R105.1 U30.P$9(A8)
SDA1°: R104.1 U30.P$12(B8) ; also sheet 4
SS0: CON57.34 U25.P$8(A7)
SS0°: U25.P$13(B7) ; also sheet 4
SS1: CON58.16 U32.P$4(A3)
SS1°: U32.P$17(B3) ; also sheet 4
TELEM: U29.D9 U31.P$1(A1)
TELEM°: U31.P$20(B1) ; also sheet 4
TX0: CON57.40 U25.P$1(A1)
TX0°: U25.P$20(B1) ; also sheet 4
TX1: CON58.6 U32.P$8(A7)
TX1°: U32.P$13(B7) ; also sheet 4
TX2: CON57.38 U25.P$4(A3)
TX2°: U25.P$17(B3) ; also sheet 4
TX3: CON58.10 U32.P$6(A5)
TX3°: U32.P$15(B5) ; also sheet 4
Unconnected: CON57.11 CON58.11 CON59.P$1 CON59.P$2 CON59.P$3 CON59.P$4 CON59.P$5 CON59.P$6 CON59.P$7 CON59.P$8 CON59.P$9 CON59.P$10 CON59.P$11 CON59.P$12 CON59.P$13 CON59.P$14 U29.3V U29.5V U29.AREF U29.IOREF U29.RESERVED U29.VIN U31.P$8(A7) U31.P$13(B7)

### Notes on the sheet
- Add pulldown 1k on output  (bitstream loading)
- 2X20 GPIO  EXPANSION HEADERS FPGA
- ARDUINO UNO R3 EXPANSION HEADER
- Analog pin, do not use
- A/D Converter and Analog Input | LTC connector
- PROJECT: EUROBOT 2017 - MOON VILLAGE
- BOARD : EXPANSION BOARD
- DESCRIPTION: | REV 0
- FPGA CONNECTORS | AUTHOR : JEREMY S.
- Analog pin, do not use
- DATE : 2016-30-10

## Sheet 8 of 8
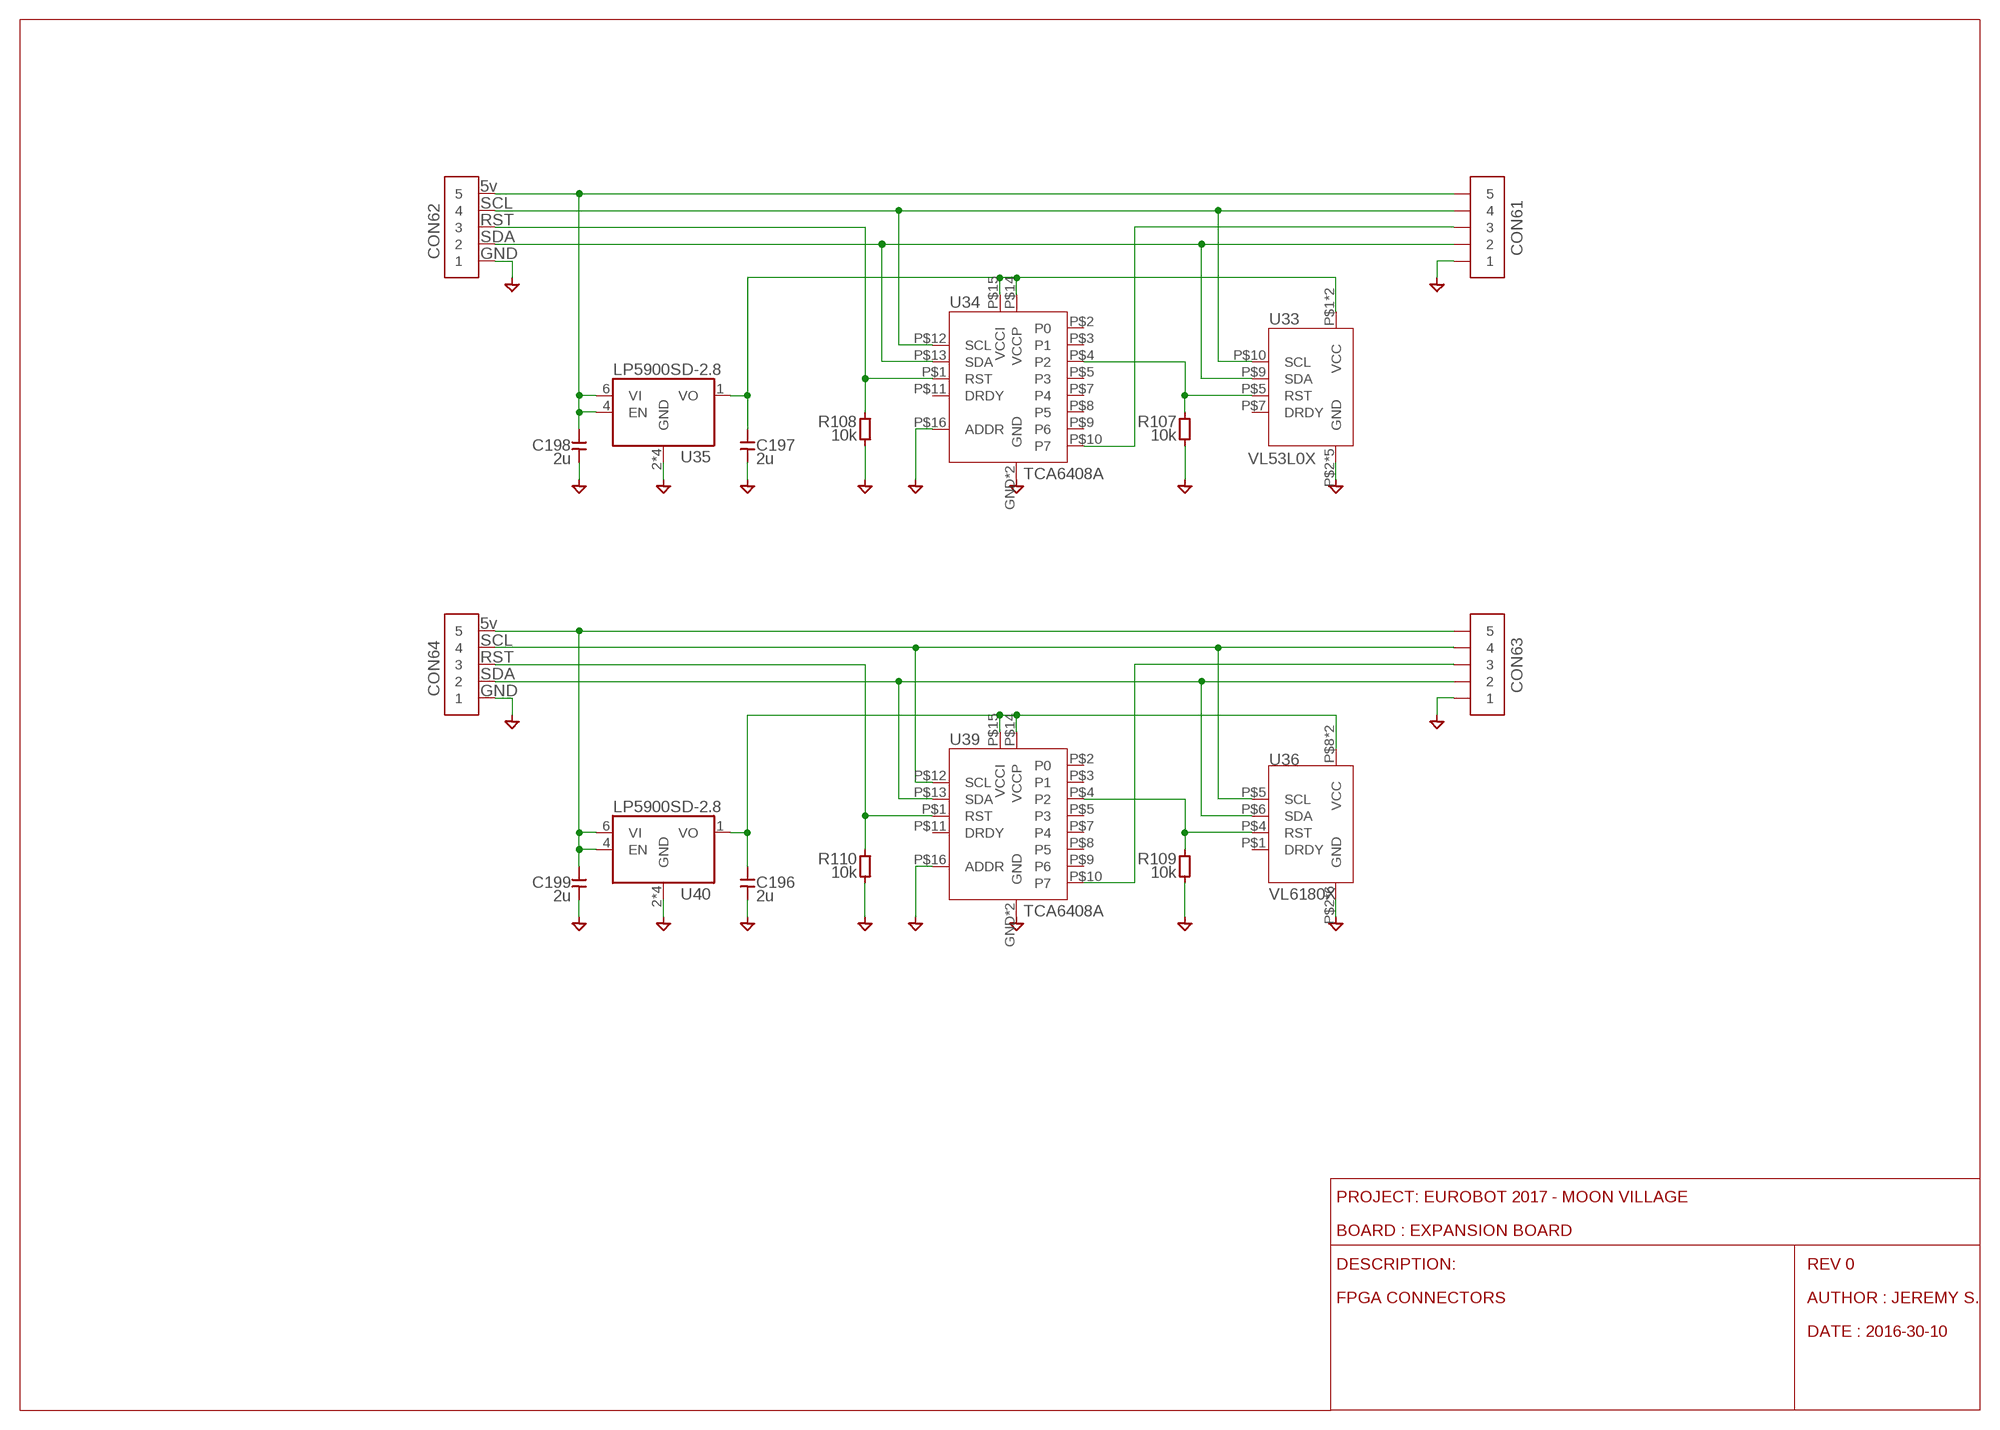
[diagram p7: schematic, sheet 8]

### Parts
C196  2u  C_603  [CAPC1608X95N]
C197  2u  C_603  [CAPC1608X95N]
C198  2u  C_603  [CAPC1608X95N]
C199  2u  C_603  [CAPC1608X95N]
CON61  CON5_2.54S  [CON254P1270X400-5S]
CON62  CON5_2.54S  [CON254P1270X400-5S]
CON63  CON5_2.54S  [CON254P1270X400-5S]
CON64  CON5_2.54S  [CON254P1270X400-5S]
R107  10k  R_402  [RESC1005X40N]
R108  10k  R_402  [RESC1005X40N]
R109  10k  R_402  [RESC1005X40N]
R110  10k  R_402  [RESC1005X40N]
U33  VL53L0X  [VL53L0X]
U34  TCA6408A  I2C_EXPTCA6408A  [QFN50P300X300X80-17N]
U35  LP5900SD-2.8  REG_EN_LP5900  [SON65P250X220X80-7N]
U36  VL6180X  [VL6180X]
U39  TCA6408A  I2C_EXPTCA6408A  [QFN50P300X300X80-17N]
U40  LP5900SD-2.8  REG_EN_LP5900  [SON65P250X220X80-7N]

### Nets
GND: C196.P$2 C197.P$2 C198.P$2 C199.P$2 CON61.1 CON62.1 CON63.1 CON64.1 R107.2 R108.2 R109.2 R110.2 U33.P$2(GND) U33.P$3(GND) U33.P$4(GND) U33.P$6(GND) U33.P$12(GND) U34.GND U34.P$6(GND) U34.P$16(ADDR) U35.2(GND) U35.3(GND) U35.5(GND) U35.GND U36.P$2(GND) U36.P$3(GND) U36.P$7(GND) U36.P$9(GND) U36.P$11(GND) U36.P$12(GND) U39.GND U39.P$6(GND) U39.P$16(ADDR) U40.2(GND) U40.3(GND) U40.5(GND) U40.GND ; also sheet 1,2,3,4,5,6,7
N$26: R107.1 U33.P$5(RST) U34.P$4(P2)
N$29: CON62.3 R108.1 U34.P$1(RST)
N$68: CON61.2 CON62.2 U33.P$9(SDA) U34.P$13(SDA)
N$69: CON61.4 CON62.4 U33.P$10(SCL) U34.P$12(SCL)
N$70: CON61.3 U34.P$10(P7)
N$71: C198.P$1 CON61.5 CON62.5 U35.4(EN) U35.6(VI)
N$72: C197.P$1 U33.P$1(VCC) U33.P$11(VCC) U34.P$14(VCCP) U34.P$15(VCCI) U35.1(VO)
N$73: C199.P$1 CON63.5 CON64.5 U40.4(EN) U40.6(VI)
N$75: CON63.4 CON64.4 U36.P$5(SCL) U39.P$12(SCL)
N$84: CON63.2 CON64.2 U36.P$6(SDA) U39.P$13(SDA)
N$93: C196.P$1 U36.P$8(VCC) U36.P$10(VCC) U39.P$14(VCCP) U39.P$15(VCCI) U40.1(VO)
N$94: CON64.3 R110.1 U39.P$1(RST)
N$95: CON63.3 U39.P$10(P7)
N$97: R109.1 U36.P$4(RST) U39.P$4(P2)
Unconnected: U33.P$7(DRDY) U34.P$2(P0) U34.P$3(P1) U34.P$5(P3) U34.P$7(P4) U34.P$8(P5) U34.P$9(P6) U34.P$11(DRDY) U36.P$1(DRDY) U39.P$2(P0) U39.P$3(P1) U39.P$5(P3) U39.P$7(P4) U39.P$8(P5) U39.P$9(P6) U39.P$11(DRDY)

### Notes on the sheet
- 5v
- SCL
- RST
- SDA
- GND
- 5v
- SCL
- RST
- SDA
- GND
- PROJECT: EUROBOT 2017 - MOON VILLAGE
- BOARD : EXPANSION BOARD
- DESCRIPTION: | REV 0
- FPGA CONNECTORS | AUTHOR : JEREMY S.
- DATE : 2016-30-10

## Library data of the parts
C1 C3-C5 C7-C11 C13 C14 C16 C17 C19-C21 C23-C25 C27-C90 C92-C199 C216 C217 C219 C220 = iocene:C
C2 C6 C12 C15 C18 C22 C26 C91 = iocene:CPOL
CON1-CON13 = iocene:CON2
CON14 CON17 = iocene:CON4
CON15 CON16 = iocene:CON10
CON18 CON19 CON26 CON27 CON31 CON32 CON36 CON41 CON49 CON53 CON61-CON64 = iocene:CON5
CON20-CON25 CON28-CON30 CON33-CON35 CON37-CON39 CON42-CON44 CON46-CON48 CON50-CON52 CON56 = iocene:CON3
CON40 CON45 = iocene:CON6
CON54 CON55 CON60 = iocene:USB
CON57 CON58 = iocene:CON40
CON59 = iocene:CON14
D1-D3 = iocene:ZENER
D4-D10 = iocene:LED
IC1 = IMU:ADS1258: edit this description Auto generated by make-symbol-device-package-bsdl.ulp Rev. 29 Source:
IC2 = IMU:ADS1278: edit this description Auto generated by make-symbol-device-package-bsdl.ulp Rev. 29 Source:
IC3 IC4 = IMU:REF5025I: edit this description Auto generated by make-symbol-device-package-bsdl.ulp Rev. 29 Source:
J1-J46 J48-J51 = iocene:JUMP
J47 = SparkFun-Connectors:M05X2: Header 5x2 Standard 10-pin dual row 0.1" header. Commonly used with AVR-ISP. Use with Spark Fun Electronics SKU: PRT-00778
K1-K4 = iocene:RELAY
L1-L10 = iocene:INDUCTANCE
Q1 = iocene:QUARTZ2
Q2 = IMU:QUARTZ
R1-R110 = iocene:R
T1-T3 = iocene:MOSFET
U1 = iocene:SN74LV4052A
U2 = iocene:BUZZER
U3 = robot:PTR08100W
U4-U6 = iocene:TPS82130
U7 U8 U12 U13 U15 U16 U18 = Texas Instruments_By_element14_Batch_1:INA240-TSSOP
U9-U11 U14 = iocene:DRV84X2
U17 U19 = iocene:ESC
U20 = iocene:LAN9514: edit this description Auto generated by make-symbol-device-package-bsdl.ulp Rev. 44 Source:
U21 U22 = Gemicom:LGA22U
U23 U35 U38 U40 = iocene:REG_EN
U24 = iocene:OPA376
U25-U28 U30-U32 = iocene:TX_0108
U29 = adafruit:ARDUINOR3: This is a new object for the new Arduino R3 - with extra pins that you may want to use (such as IOref, and duplicated A4/A5
U33 = iocene:VL53L0X
U34 U39 = iocene:I2C_EXP
U36 = iocene:VL6180X
U37 = 9dof-devboard-temp:MPU-9250: NC pin 19. 2-6 & 14-17 not internally connected. May be used for PCB trace routing.; PROD_ID: IC-13192